# EAGLE schematic esp32-kitchensink (EAGLE 9.6.2)

## Sheet 1 of 8
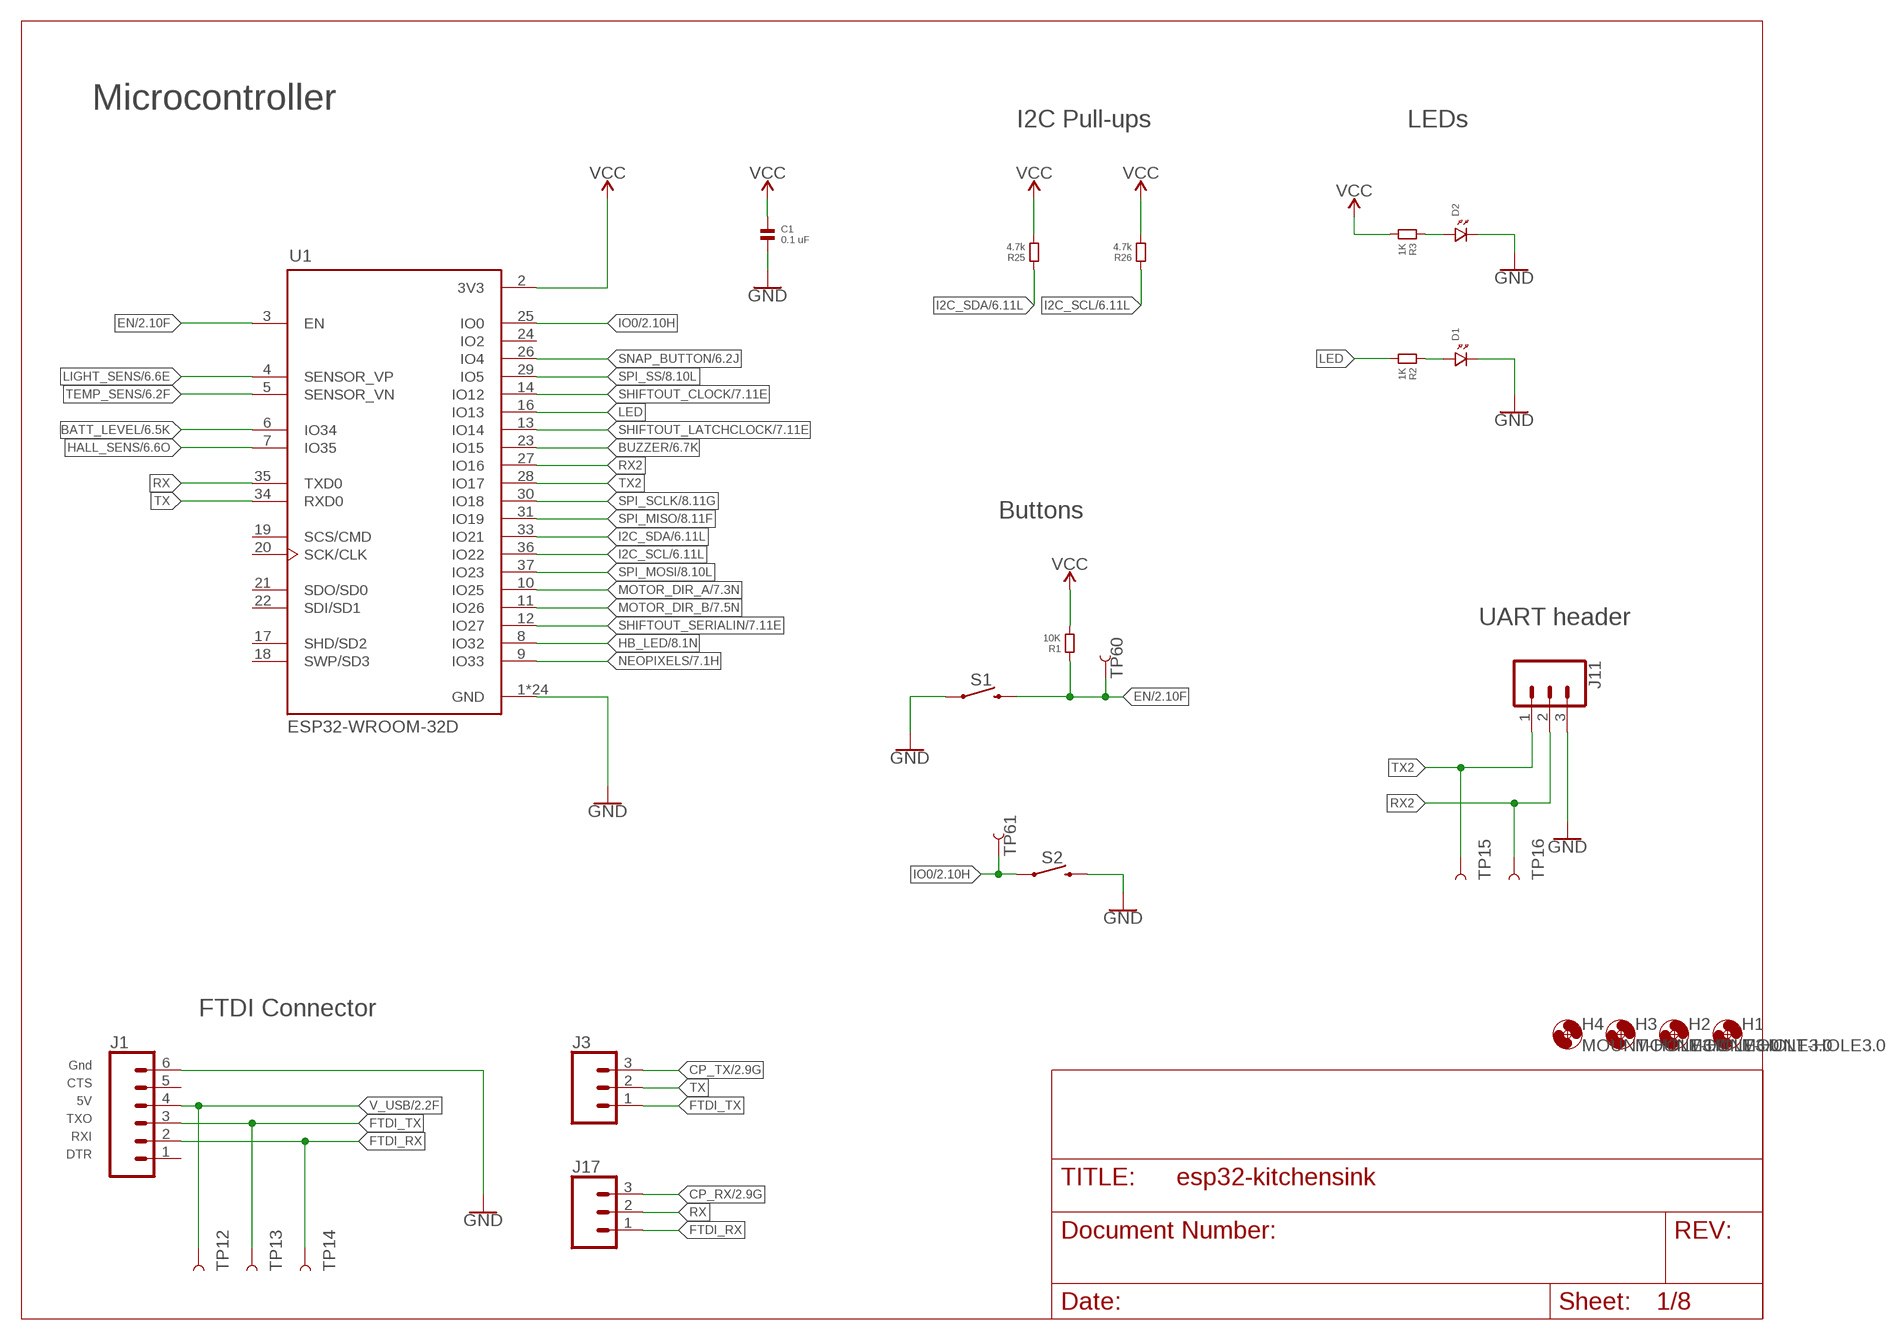
[diagram p0: schematic, sheet 1]

### Parts
C1  0.1 uF  CAPACITOR.1206  [1206]
D1  LED.1206  [1206.LED]
D2  LED.1206  [1206.LED]
H1  MOUNT-HOLE3.0  [3,0]
H2  MOUNT-HOLE3.0  [3,0]
H3  MOUNT-HOLE3.0  [3,0]
H4  MOUNT-HOLE3.0  [3,0]
J1  CONN_06  [1X06-SMD_RA_MALE_NO_HOLES]
J3  CONN_03LONGPADS  [1X03_LONGPADS]
J11  CONN_03SMD_RA_MALE  [1X03_SMD_RA_MALE]
J17  CONN_03LONGPADS  [1X03_LONGPADS]
R1  10K  RESISTOR.1206  [1206]
R2  1K  RESISTOR.1206  [1206]
R3  1K  RESISTOR.1206  [1206]
R25  4.7k  RESISTOR.1206  [1206]
R26  4.7k  RESISTOR.1206  [1206]
S1  MOMENTARY-SWITCH-SPST-SMD-5.2MM  [TACTILE_SWITCH_SMD_5.2MM]
S2  MOMENTARY-SWITCH-SPST-SMD-5.2MM  [TACTILE_SWITCH_SMD_5.2MM]
TP12  TEST-POINT3X5  [PAD.03X.05]
TP13  TEST-POINT3X5  [PAD.03X.05]
TP14  TEST-POINT3X5  [PAD.03X.05]
TP15  TEST-POINT3X5  [PAD.03X.05]
TP16  TEST-POINT3X5  [PAD.03X.05]
TP60  TEST-POINT3X5  [PAD.03X.05]
TP61  TEST-POINT3X5  [PAD.03X.05]
U1  ESP32-WROOM-32D  [MODULE_ESP32-WROOM-32D]

### Nets
BATT_LEVEL: U1.6(IO34) ; also sheet 6
BUZZER: U1.23(IO15) ; also sheet 6
CP_RX: J17.3 ; also sheet 2
CP_TX: J3.3 ; also sheet 2
EN: R1.1 S1.3 TP60.P$1 U1.3(EN) ; also sheet 2
FTDI_RX: J1.2 J17.1 TP14.P$1
FTDI_TX: J1.3 J3.1 TP13.P$1
GND: D1.P$2 D2.P$2 J1.6 J11.3 S1.1 ; also sheet 2,3,4,5,6,7,8
HALL_SENS: U1.7(IO35) ; also sheet 6
HB_LED: U1.8(IO32) ; also sheet 8
I2C_SCL: R26.1 U1.36(IO22) ; also sheet 6,8
I2C_SDA: R25.1 U1.33(IO21) ; also sheet 6,8
IO0: S2.1 TP61.P$1 U1.25(IO0) ; also sheet 2
LED: R2.2 U1.16(IO13)
LIGHT_SENS: U1.4(SENSOR_VP) ; also sheet 6
MOTOR_DIR_A: U1.10(IO25) ; also sheet 7
MOTOR_DIR_B: U1.11(IO26) ; also sheet 7
N$2: C1.1 ; supply symbol labelled VCC
N$3: C1.2 S2.3 ; supply symbol labelled GND
N$4: U1.1(GND) U1.15(GND) U1.38(GND) U1.39_1(GND) U1.39_2(GND) U1.39_3(GND) U1.39_4(GND) U1.39_5(GND) U1.39_6(GND) U1.39_7(GND) U1.39_8(GND) U1.39_9(GND) U1.39_10(GND) U1.39_11(GND) U1.39_12(GND) U1.39_13(GND) U1.39_14(GND) U1.39_15(GND) U1.39_16(GND) U1.39_17(GND) U1.39_18(GND) U1.39_19(GND) U1.39_20(GND) U1.39_21(GND) ; supply symbol labelled GND
N$7: D1.P$1 R2.1
N$8: R3.2 ; supply symbol labelled VCC
N$9: D2.P$1 R3.1
NEOPIXELS: U1.9(IO33) ; also sheet 7
RX: J17.2 U1.35(TXD0)
RX2: J11.2 TP16.P$1 U1.27(IO16)
SHIFTOUT_CLOCK: U1.14(IO12) ; also sheet 7
SHIFTOUT_LATCHCLOCK: U1.13(IO14) ; also sheet 7
SHIFTOUT_SERIALIN: U1.12(IO27) ; also sheet 7
SNAP_BUTTON: U1.26(IO4) ; also sheet 6
SPI_MISO: U1.31(IO19) ; also sheet 8
SPI_MOSI: U1.37(IO23) ; also sheet 8
SPI_SCLK: U1.30(IO18) ; also sheet 8
SPI_SS: U1.29(IO5) ; also sheet 8
TEMP_SENS: U1.5(SENSOR_VN) ; also sheet 6
TX: J3.2 U1.34(RXD0)
TX2: J11.1 TP15.P$1 U1.28(IO17)
V_USB: J1.4 TP12.P$1 ; also sheet 2,3
VCC: R1.2 R25.2 R26.2 U1.2(3V3) ; also sheet 2,3,6,7,8
Unconnected: J1.1 J1.5 U1.17(SHD/SD2) U1.18(SWP/SD3) U1.19(SCS/CMD) U1.20(SCK/CLK) U1.21(SDO/SD0) U1.22(SDI/SD1) U1.24(IO2)

### Notes on the sheet
- Microcontroller
- I2C Pull-ups | LEDs
- Buttons
- UART header
- FTDI Connector
- Gnd
- CTS
- 5V
- TXO
- RXI
- DTR

## Sheet 2 of 8
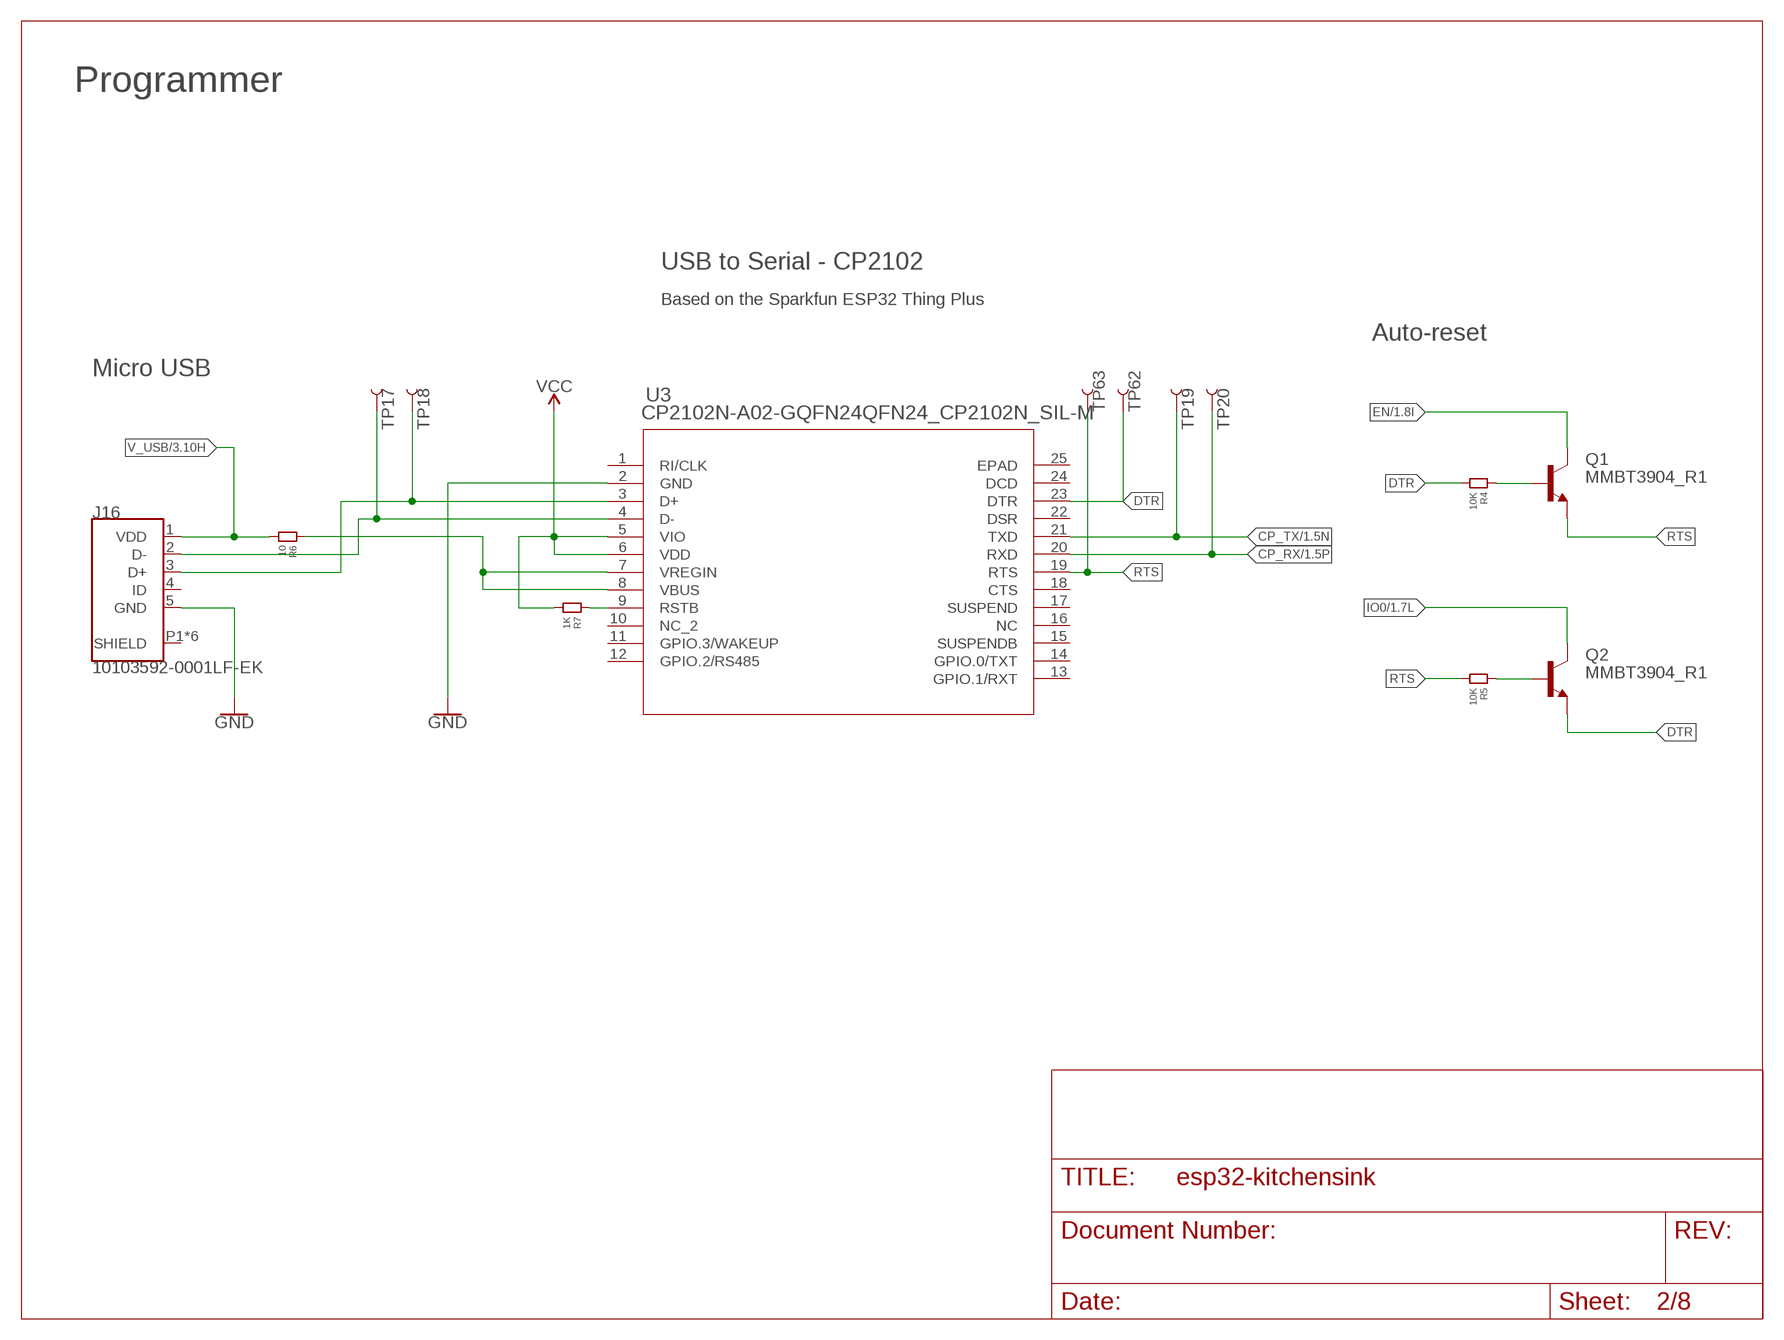
[diagram p1: schematic, sheet 2]

### Parts
J16  10103592-0001LF-EK  [AMPHENOL_10103592-0001LF]
Q1  MMBT3904_R1  BC846  [SOT23]
Q2  MMBT3904_R1  BC846  [SOT23]
R4  10K  RESISTOR.1206  [1206]
R5  10K  RESISTOR.1206  [1206]
R6  10  RESISTOR.1206  [1206]
R7  1K  RESISTOR.1206  [1206]
TP17  TEST-POINT3X5  [PAD.03X.05]
TP18  TEST-POINT3X5  [PAD.03X.05]
TP19  TEST-POINT3X5  [PAD.03X.05]
TP20  TEST-POINT3X5  [PAD.03X.05]
TP62  TEST-POINT3X5  [PAD.03X.05]
TP63  TEST-POINT3X5  [PAD.03X.05]
U3  CP2102N-A02-GQFN24QFN24_CP2102N_SIL-M  [QFN24_CP2102N_SIL-M]

### Nets
CP_RX: TP20.P$1 U3.20(RXD) ; also sheet 1
CP_TX: TP19.P$1 U3.21(TXD) ; also sheet 1
DTR: Q2.2(E) R4.2 TP62.P$1 U3.23(DTR)
EN: Q1.3(C) ; also sheet 1
GND: J16.5(GND) U3.2(GND) ; also sheet 1,3,4,5,6,7,8
IO0: Q2.3(C) ; also sheet 1
N$1: R6.1 U3.7(VREGIN) U3.8(VBUS)
N$5: J16.3(D+) TP18.P$1 U3.3(D+)
N$6: J16.2(D-) TP17.P$1 U3.4(D-)
N$10: Q1.1(B) R4.1
N$11: Q2.1(B) R5.1
N$12: R7.1 U3.9(RSTB)
RTS: Q1.2(E) R5.2 TP63.P$1 U3.19(RTS)
V_USB: J16.1(VDD) R6.2 ; also sheet 1,3
VCC: R7.2 U3.5(VIO) U3.6(VDD) ; also sheet 1,3,6,7,8
Unconnected: J16.4(ID) U3.1(RI/CLK) U3.10(NC_2) U3.11(GPIO.3/WAKEUP) U3.12(GPIO.2/RS485) U3.13(GPIO.1/RXT) U3.14(GPIO.0/TXT) U3.15(SUSPENDB) U3.16(NC) U3.17(SUSPEND) U3.18(CTS) U3.22(DSR) U3.24(DCD) U3.25(EPAD)

### Notes on the sheet
- Programmer
- USB to Serial - CP2102
- Based on the Sparkfun ESP32 Thing Plus
- Auto-reset
- Micro USB

## Sheet 3 of 8
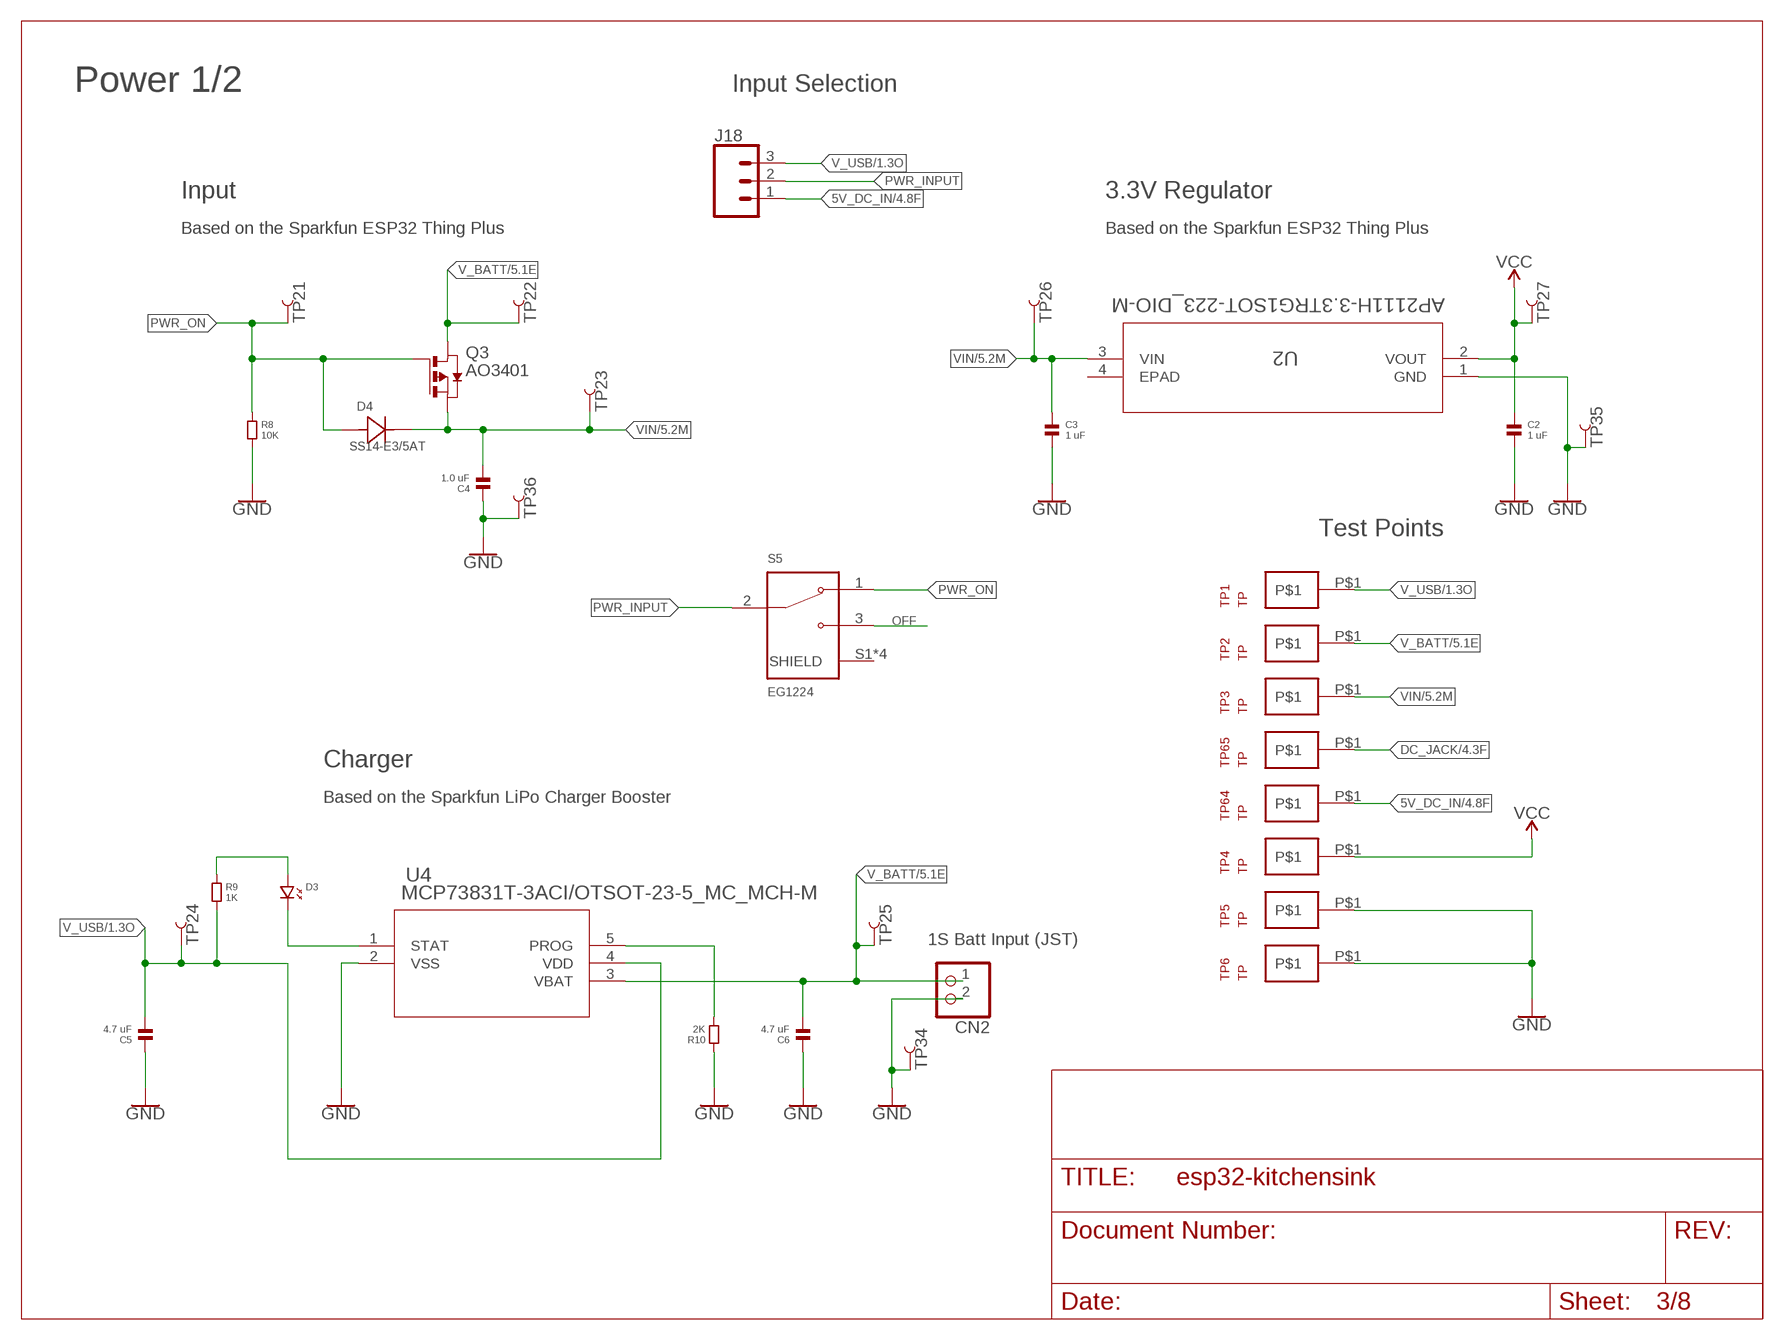
[diagram p2: schematic, sheet 3]

### Parts
C2  1 uF  CAPACITOR.1206  [1206]
C3  1 uF  CAPACITOR.1206  [1206]
C4  1.0 uF  CAPACITOR.1206  [1206]
C5  4.7 uF  CAPACITOR.1206  [1206]
C6  4.7 uF  CAPACITOR.1206  [1206]
CN2  JST_2PIN-THM-RA  [JST-PH-2-THM-RA]
D3  LED.1206  [1206.LED]
D4  SS14-E3/5AT  [DIODE_DO214AC]
J18  CONN_03  [1X03]
Q3  AO3401  [SOT23]
R8  10K  RESISTOR.1206  [1206]
R9  1K  RESISTOR.1206  [1206]
R10  2K  RESISTOR.1206  [1206]
S5  EG1224  [SW_EG1224]
TP1  TP  [TP]
TP2  TP  [TP]
TP3  TP  [TP]
TP4  TP  [TP]
TP5  TP  [TP]
TP6  TP  [TP]
TP21  TEST-POINT3X5  [PAD.03X.05]
TP22  TEST-POINT3X5  [PAD.03X.05]
TP23  TEST-POINT3X5  [PAD.03X.05]
TP24  TEST-POINT3X5  [PAD.03X.05]
TP25  TEST-POINT3X5  [PAD.03X.05]
TP26  TEST-POINT3X5  [PAD.03X.05]
TP27  TEST-POINT3X5  [PAD.03X.05]
TP34  TEST-POINT3X5  [PAD.03X.05]
TP35  TEST-POINT3X5  [PAD.03X.05]
TP36  TEST-POINT3X5  [PAD.03X.05]
TP64  TP  [TP]
TP65  TP  [TP]
U2  AP2111H-3.3TRG1SOT-223_DIO-M  [SOT-223_DIO-M]
U4  MCP73831T-3ACI/OTSOT-23-5_MC_MCH-M  [SOT-23-5_MC_MCH-M]

### Nets
5V_DC_IN: J18.1 TP64.P$1 ; also sheet 4
DC_JACK: TP65.P$1 ; also sheet 4
GND: C2.2 C3.2 C4.1 C5.1 C6.1 CN2.2 R8.2 R10.1 TP5.P$1 TP6.P$1 TP34.P$1 TP35.P$1 TP36.P$1 U2.1(GND) U4.2(VSS) ; also sheet 1,2,4,5,6,7,8
N$13: D3.P$1 R9.1
N$14: D3.P$2 U4.1(STAT)
N$15: R10.2 U4.5(PROG)
OFF: S5.3
PWR_INPUT: J18.2 S5.2
PWR_ON: D4.2 Q3.1(G) R8.1 S5.1 TP21.P$1
V_BATT: C6.2 CN2.1 Q3.3(D) TP2.P$1 TP22.P$1 TP25.P$1 U4.3(VBAT) ; also sheet 5,6
V_USB: C5.2 J18.3 R9.2 TP1.P$1 TP24.P$1 U4.4(VDD) ; also sheet 1,2
VCC: C2.1 TP4.P$1 TP27.P$1 U2.2(VOUT) ; also sheet 1,2,6,7,8
VIN: C3.1 C4.2 D4.1 Q3.2(S) TP3.P$1 TP23.P$1 TP26.P$1 U2.3(VIN) ; also sheet 5
Unconnected: S5.S1(SHIELD) S5.S2(SHIELD) S5.S3(SHIELD) S5.S4(SHIELD) U2.4(EPAD)

### Notes on the sheet
- Power 1/2 | Input Selection
- Input | 3.3V Regulator
- Based on the Sparkfun ESP32 Thing Plus | Based on the Sparkfun ESP32 Thing Plus
- Test Points
- Charger
- Based on the Sparkfun LiPo Charger Booster
- 1S Batt Input (JST)

## Sheet 4 of 8
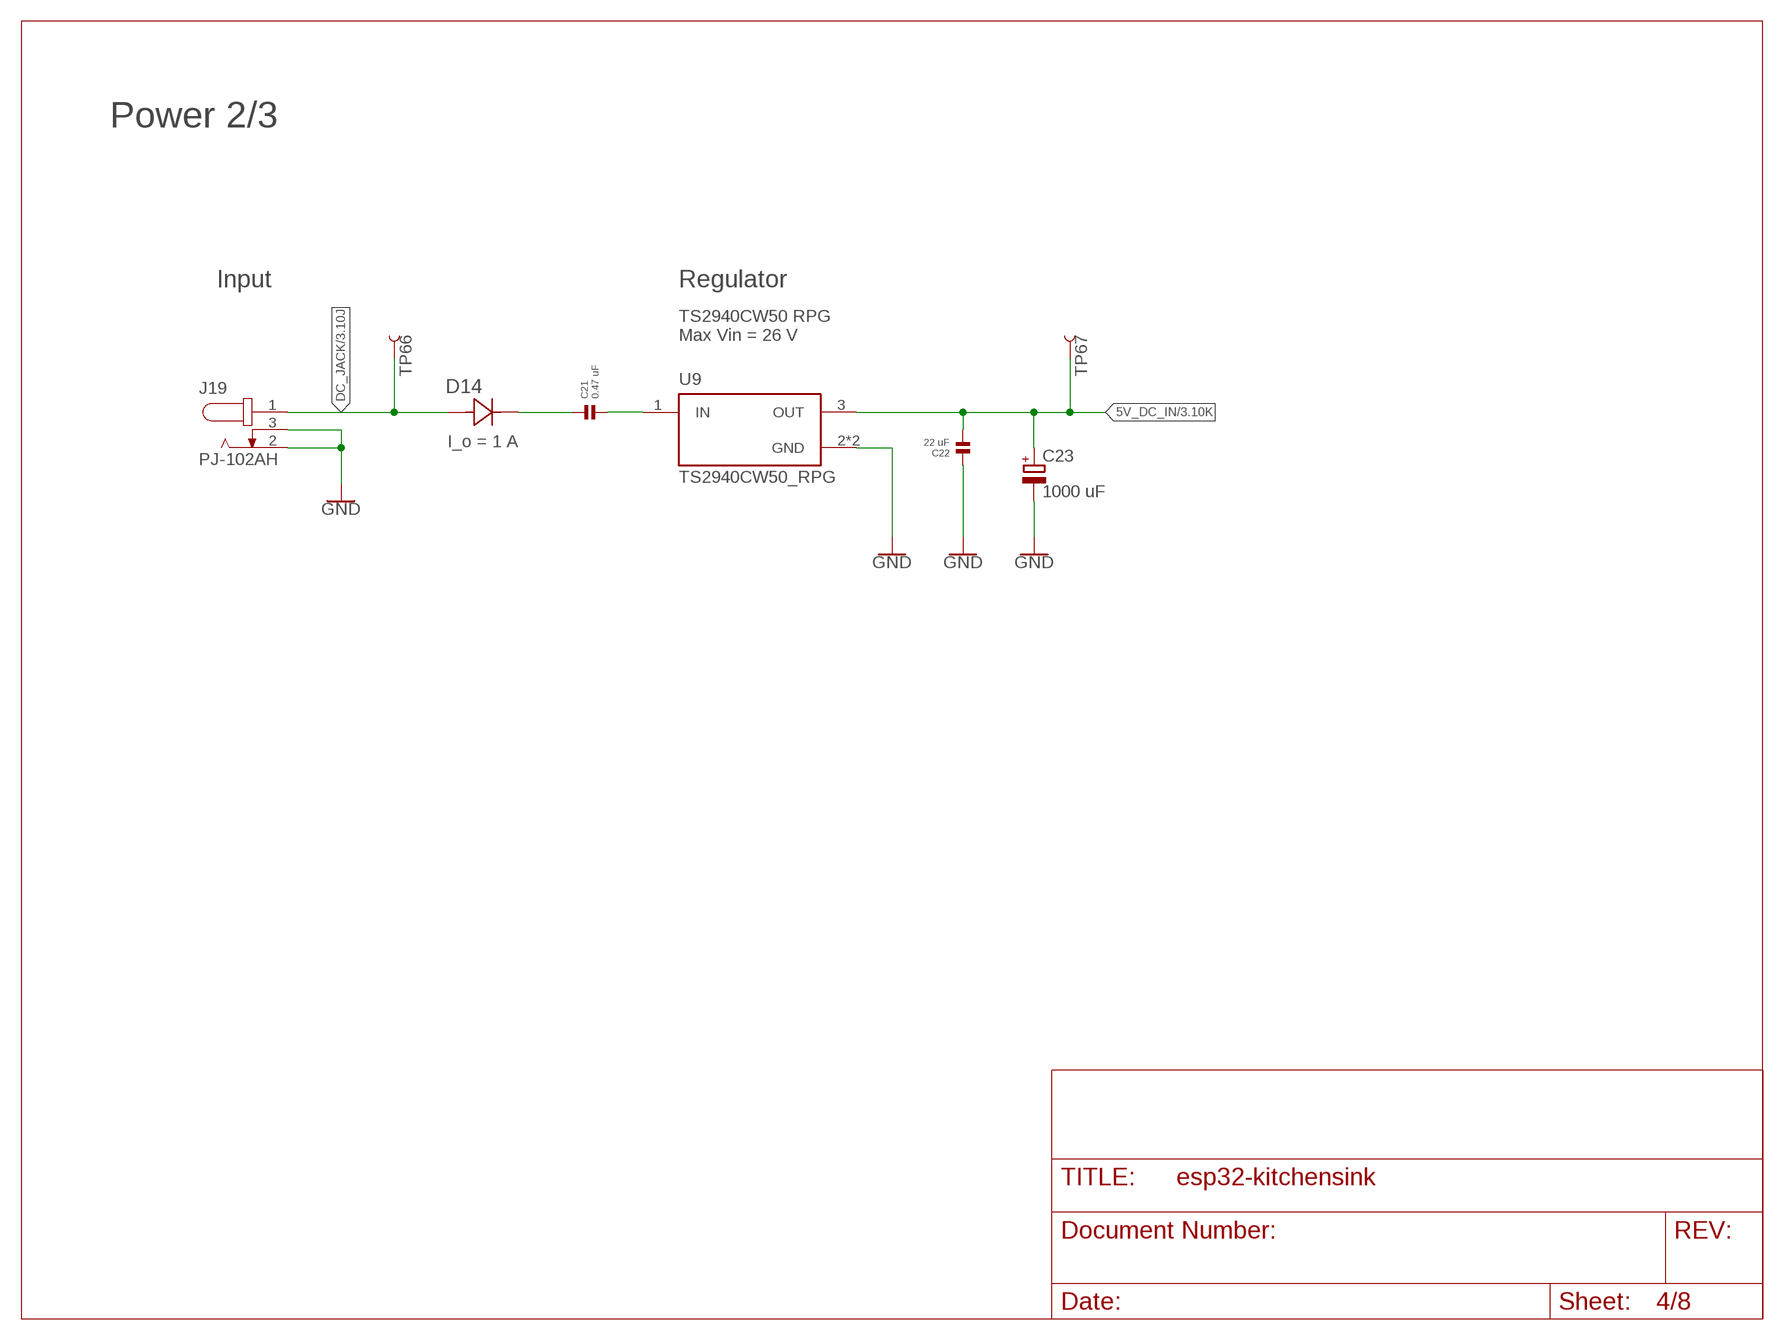
[diagram p3: schematic, sheet 4]

### Parts
C21  0.47 uF  CAPACITOR.1206  [1206]
C22  22 uF  CAPACITOR.1206  [1206]
C23  1000 uF  CPOL-EU140CLH-1010  [140CLH-1010]
D14  RS1BB-13-FSMA_DIO-M  [SMA_DIO-M]
J19  PJ-102AH  [CUI_PJ-102AH]
TP66  TEST-POINT3X5  [PAD.03X.05]
TP67  TEST-POINT3X5  [PAD.03X.05]
U9  TS2940CW50_RPG  [VREG_TS2940CW50_RPG]

### Nets
5V_DC_IN: C22.2 C23.+ TP67.P$1 U9.3(OUT) ; also sheet 3
DC_JACK: D14.2 J19.1 TP66.P$1 ; also sheet 3
GND: C22.1 C23.- J19.2 J19.3 U9.2(GND) U9.4(GND) ; also sheet 1,2,3,5,6,7,8
N$32: C21.2 U9.1(IN)
N$43: C21.1 D14.1

### Notes on the sheet
- Power 2/3
- Input | Regulator
- TS2940CW50 RPG
  Max Vin = 26 V
- I_o = 1 A

## Sheet 5 of 8
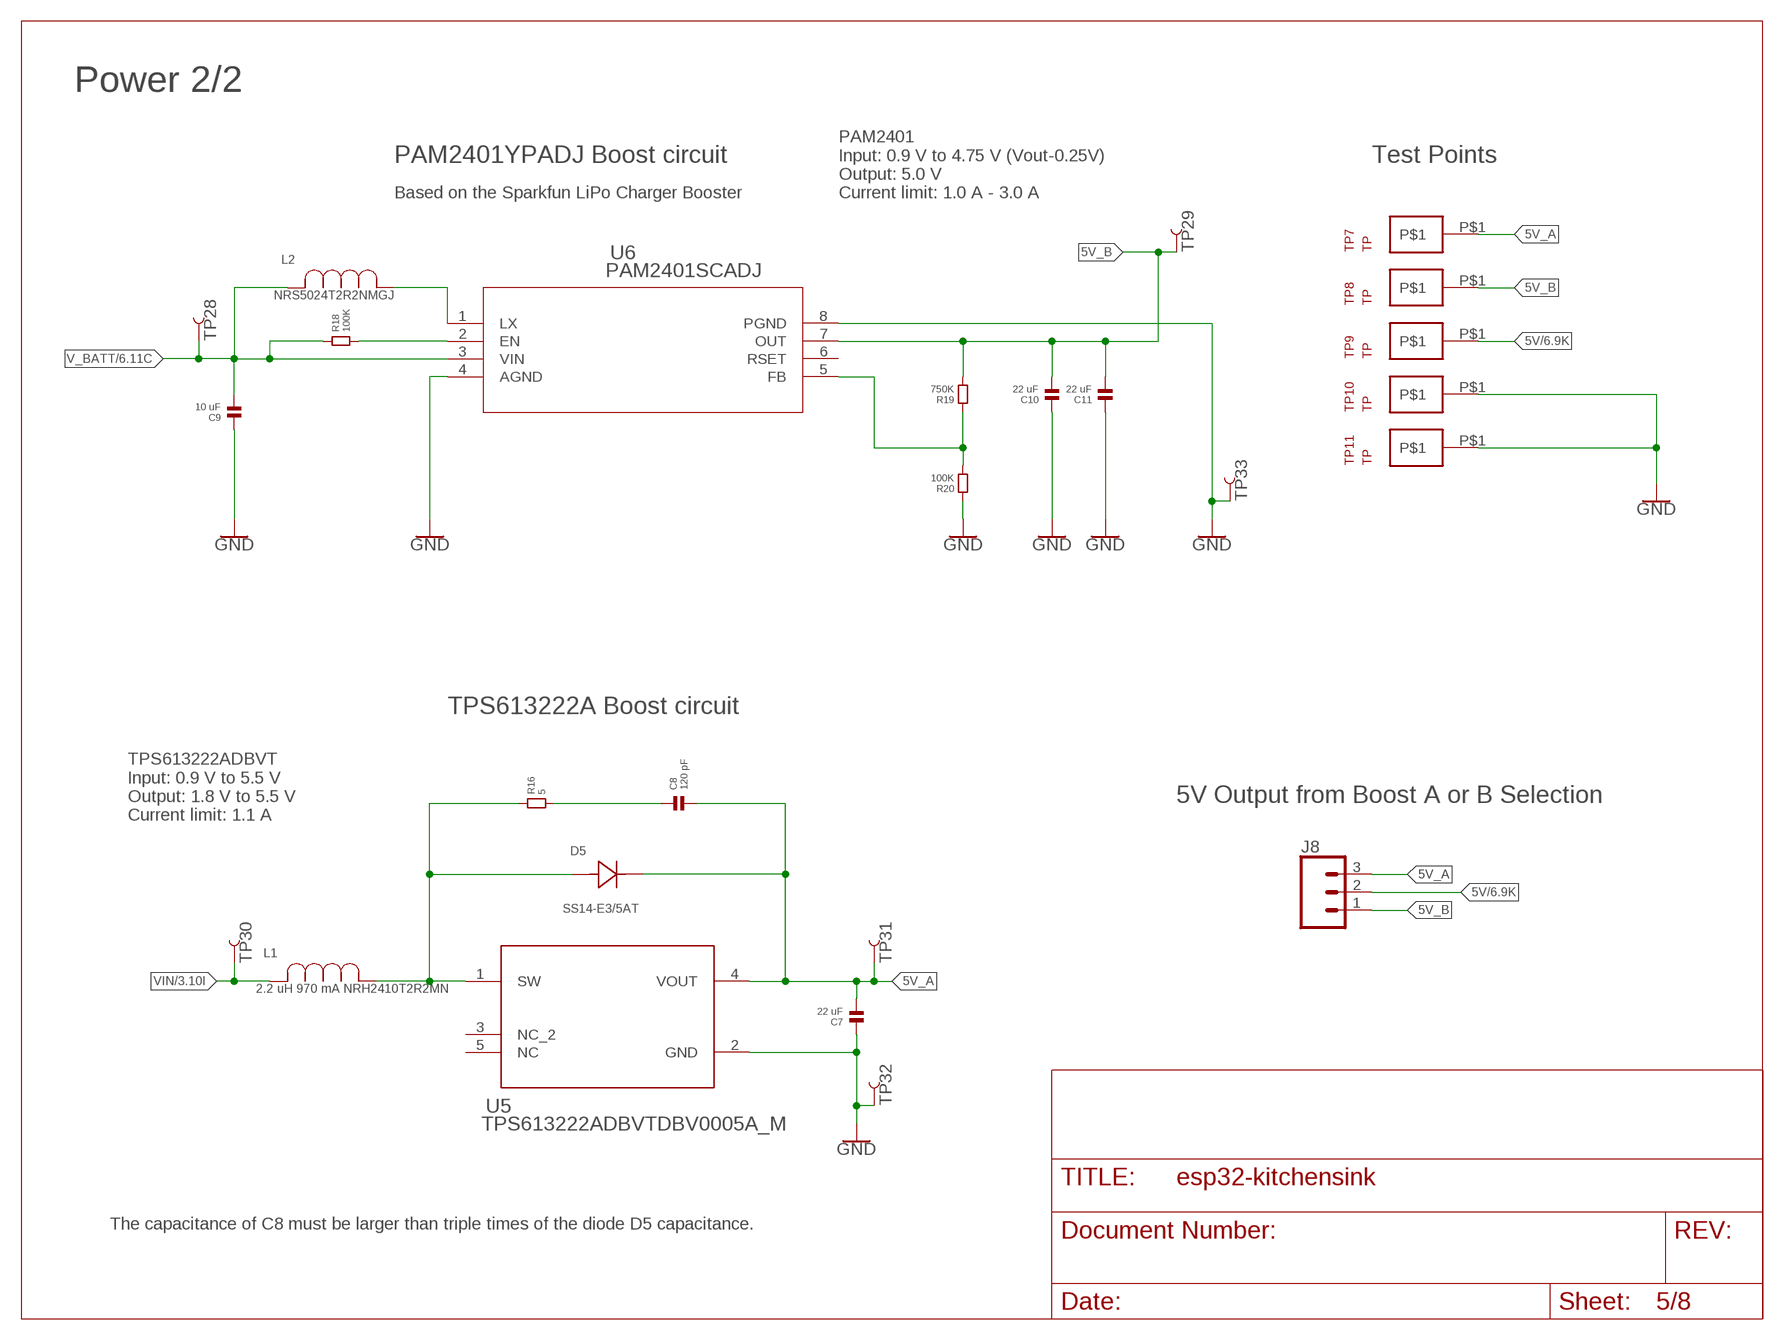
[diagram p4: schematic, sheet 5]

### Parts
C7  22 uF  CAPACITOR.1206  [1206]
C8  120 pF  CAPACITOR.1206  [1206]
C9  10 uF  CAPACITOR.1206  [1206]
C10  22 uF  CAPACITOR.1206  [1206]
C11  22 uF  CAPACITOR.1206  [1206]
D5  SS14-E3/5AT  [DIODE_DO214AC]
J8  CONN_03  [1X03]
L1  2.2 uH 970 mA NRH2410T2R2MN  NRH2410T2R2MN  [IND_TAIYO_NRH2410_TAY]
L2  NRS5024T2R2NMGJ  [IND_NRS5024_TAY]
R16  5  RESISTOR.1206  [1206]
R18  100K  RESISTOR.1206  [1206]
R19  750K  RESISTOR.1206  [1206]
R20  100K  RESISTOR.1206  [1206]
TP7  TP  [TP]
TP8  TP  [TP]
TP9  TP  [TP]
TP10  TP  [TP]
TP11  TP  [TP]
TP28  TEST-POINT3X5  [PAD.03X.05]
TP29  TEST-POINT3X5  [PAD.03X.05]
TP30  TEST-POINT3X5  [PAD.03X.05]
TP31  TEST-POINT3X5  [PAD.03X.05]
TP32  TEST-POINT3X5  [PAD.03X.05]
TP33  TEST-POINT3X5  [PAD.03X.05]
U5  TPS613222ADBVTDBV0005A_M  [DBV0005A_M]
U6  PAM2401SCADJ  [MSOP8_DIO]

### Nets
5V: J8.2 TP9.P$1 ; also sheet 6,7,8
5V_A: C7.2 C8.2 D5.1 J8.3 TP7.P$1 TP31.P$1 U5.4(VOUT)
5V_B: C10.2 C11.2 J8.1 R19.2 TP8.P$1 TP29.P$1 U6.7(OUT)
GND: C7.1 C9.1 C10.1 C11.1 R20.1 TP10.P$1 TP11.P$1 TP32.P$1 TP33.P$1 U5.2(GND) U6.4(AGND) U6.8(PGND) ; also sheet 1,2,3,4,6,7,8
N$16: L2.1 U6.1(LX)
N$17: D5.2 L1.1 R16.1 U5.1(SW)
N$22: C8.1 R16.2
N$25: R18.2 U6.2(EN)
N$26: R19.1 R20.2 U6.5(FB)
V_BATT: C9.2 L2.2 R18.1 TP28.P$1 U6.3(VIN) ; also sheet 3,6
VIN: L1.2 TP30.P$1 ; also sheet 3
Unconnected: U5.3(NC_2) U5.5(NC) U6.6(RSET)

### Notes on the sheet
- Power 2/2
- PAM2401YPADJ Boost circuit | Test Points
- Based on the Sparkfun LiPo Charger Booster
- PAM2401 
  Input: 0.9 V to 4.75 V (Vout-0.25V)
  Output: 5.0 V 
  Current limit: 1.0 A - 3.0 A
- TPS613222A Boost circuit
- 5V Output from Boost A or B Selection
- TPS613222ADBVT
  Input: 0.9 V to 5.5 V 
  Output: 1.8 V to 5.5 V 
  Current limit: 1.1 A
- The capacitance of C8 must be larger than triple times of the diode D5 capacitance.

## Sheet 6 of 8
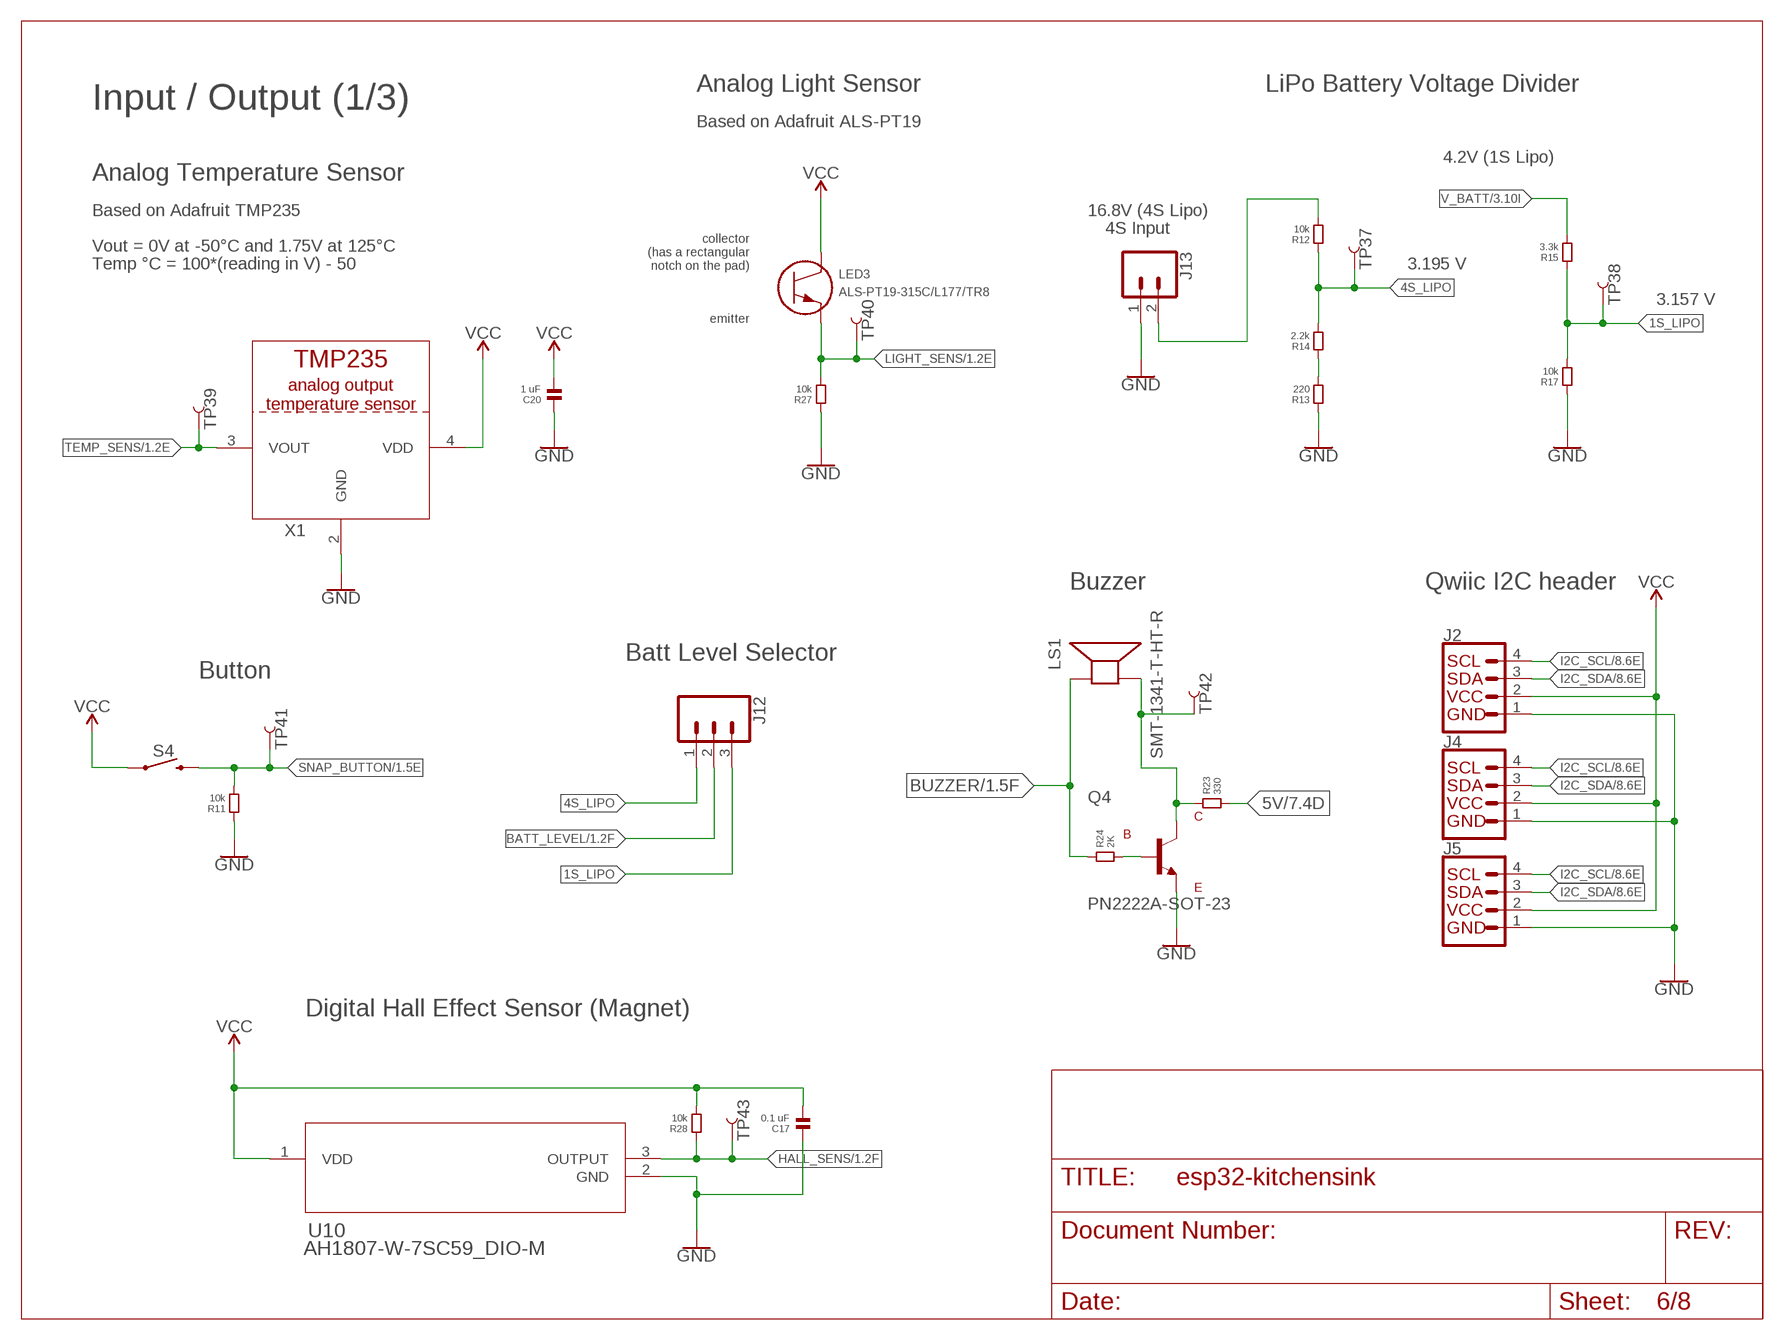
[diagram p5: schematic, sheet 6]

### Parts
C17  0.1 uF  CAPACITOR.1206  [1206]
C20  1 uF  CAPACITOR.1206  [1206]
J2  QWIIC_CONNECTORJS-1MM  [1X04_1MM_RA]
J4  QWIIC_CONNECTORJS-1MM  [1X04_1MM_RA]
J5  QWIIC_CONNECTORJS-1MM  [1X04_1MM_RA]
J12  CONN_03LONGPADS  [1X03_LONGPADS]
J13  CONN_02LOCK_LONGPADS  [1X02_LOCK_LONGPADS]
LED3  ALS-PT19-315C/L177/TR8  [LED_77/TR8_EVE]
LS1  SMT-1341-T-HT-R  [XDCR_SMT-1341-T-HT-R]
Q4  PN2222A-SOT-23  [PN2222A-SOT-23]
R11  10k  RESISTOR.1206  [1206]
R12  10k  RESISTOR.1206  [1206]
R13  220  RESISTOR.1206  [1206]
R14  2.2k  RESISTOR.1206  [1206]
R15  3.3k  RESISTOR.1206  [1206]
R17  10k  RESISTOR.1206  [1206]
R23  330  RESISTOR.1206  [1206]
R24  2K  RESISTOR.1206  [1206]
R27  10k  RESISTOR.1206  [1206]
R28  10k  RESISTOR.1206  [1206]
S4  MOMENTARY-SWITCH-SPST-SMD-5.2MM  [TACTILE_SWITCH_SMD_5.2MM]
TP37  TEST-POINT3X5  [PAD.03X.05]
TP38  TEST-POINT3X5  [PAD.03X.05]
TP39  TEST-POINT3X5  [PAD.03X.05]
TP40  TEST-POINT3X5  [PAD.03X.05]
TP41  TEST-POINT3X5  [PAD.03X.05]
TP42  TEST-POINT3X5  [PAD.03X.05]
TP43  TEST-POINT3X5  [PAD.03X.05]
U10  AH1807-W-7SC59_DIO-M  [SC59_DIO-M]
X1  TMP235_DCKR  [SC70-5]

### Nets
1S_LIPO: J12.3 R15.1 R17.2 TP38.P$1
4S_LIPO: J12.1 R12.1 R14.2 TP37.P$1
5V: R23.2 ; also sheet 5,7,8
BATT_LEVEL: J12.2 ; also sheet 1
BUZZER: LS1.P R24.1 ; also sheet 1
GND: C17.1 C20.1 J2.1(GND) J4.1(GND) J5.1(GND) J13.1 Q4.EMITTER R11.1 R13.1 R17.1 R27.1 U10.2(GND) X1.2(GND) ; also sheet 1,2,3,4,5,7,8
HALL_SENS: R28.1 TP43.P$1 U10.3(OUTPUT) ; also sheet 1
I2C_SCL: J2.4(SCL) J4.4(SCL) J5.4(SCL) ; also sheet 1,8
I2C_SDA: J2.3(SDA) J4.3(SDA) J5.3(SDA) ; also sheet 1,8
LIGHT_SENS: LED3.2 R27.2 TP40.P$1 ; also sheet 1
N$20: J13.2 R12.2
N$21: R13.2 R14.1
N$33: LS1.N Q4.COLLECTOR R23.1 TP42.P$1
N$35: Q4.BASE R24.2
SNAP_BUTTON: R11.2 S4.3 TP41.P$1 ; also sheet 1
TEMP_SENS: TP39.P$1 X1.3(VOUT) ; also sheet 1
V_BATT: R15.2 ; also sheet 3,5
VCC: C17.2 C20.2 J2.2(VCC) J4.2(VCC) J5.2(VCC) LED3.1 R28.2 S4.1 U10.1(VDD) X1.4(VDD) ; also sheet 1,2,3,7,8

### Notes on the sheet
- Analog Light Sensor | LiPo Battery Voltage Divider
- Input / Output (1/3)
- Based on Adafruit ALS-PT19
- 4.2V (1S Lipo)
- Analog Temperature Sensor
- Based on Adafruit TMP235 | 16.8V (4S Lipo)
- 4S Input
- Vout = 0V at -50°C and 1.75V at 125°C
- Temp °C = 100*(reading in V) - 50
- collector
  (has a rectangular
  notch on the pad)
- 3.195 V
- 3.157 V
- emitter
- Buzzer | Qwiic I2C header
- Batt Level Selector
- Button
- Digital Hall Effect Sensor (Magnet)

## Sheet 7 of 8
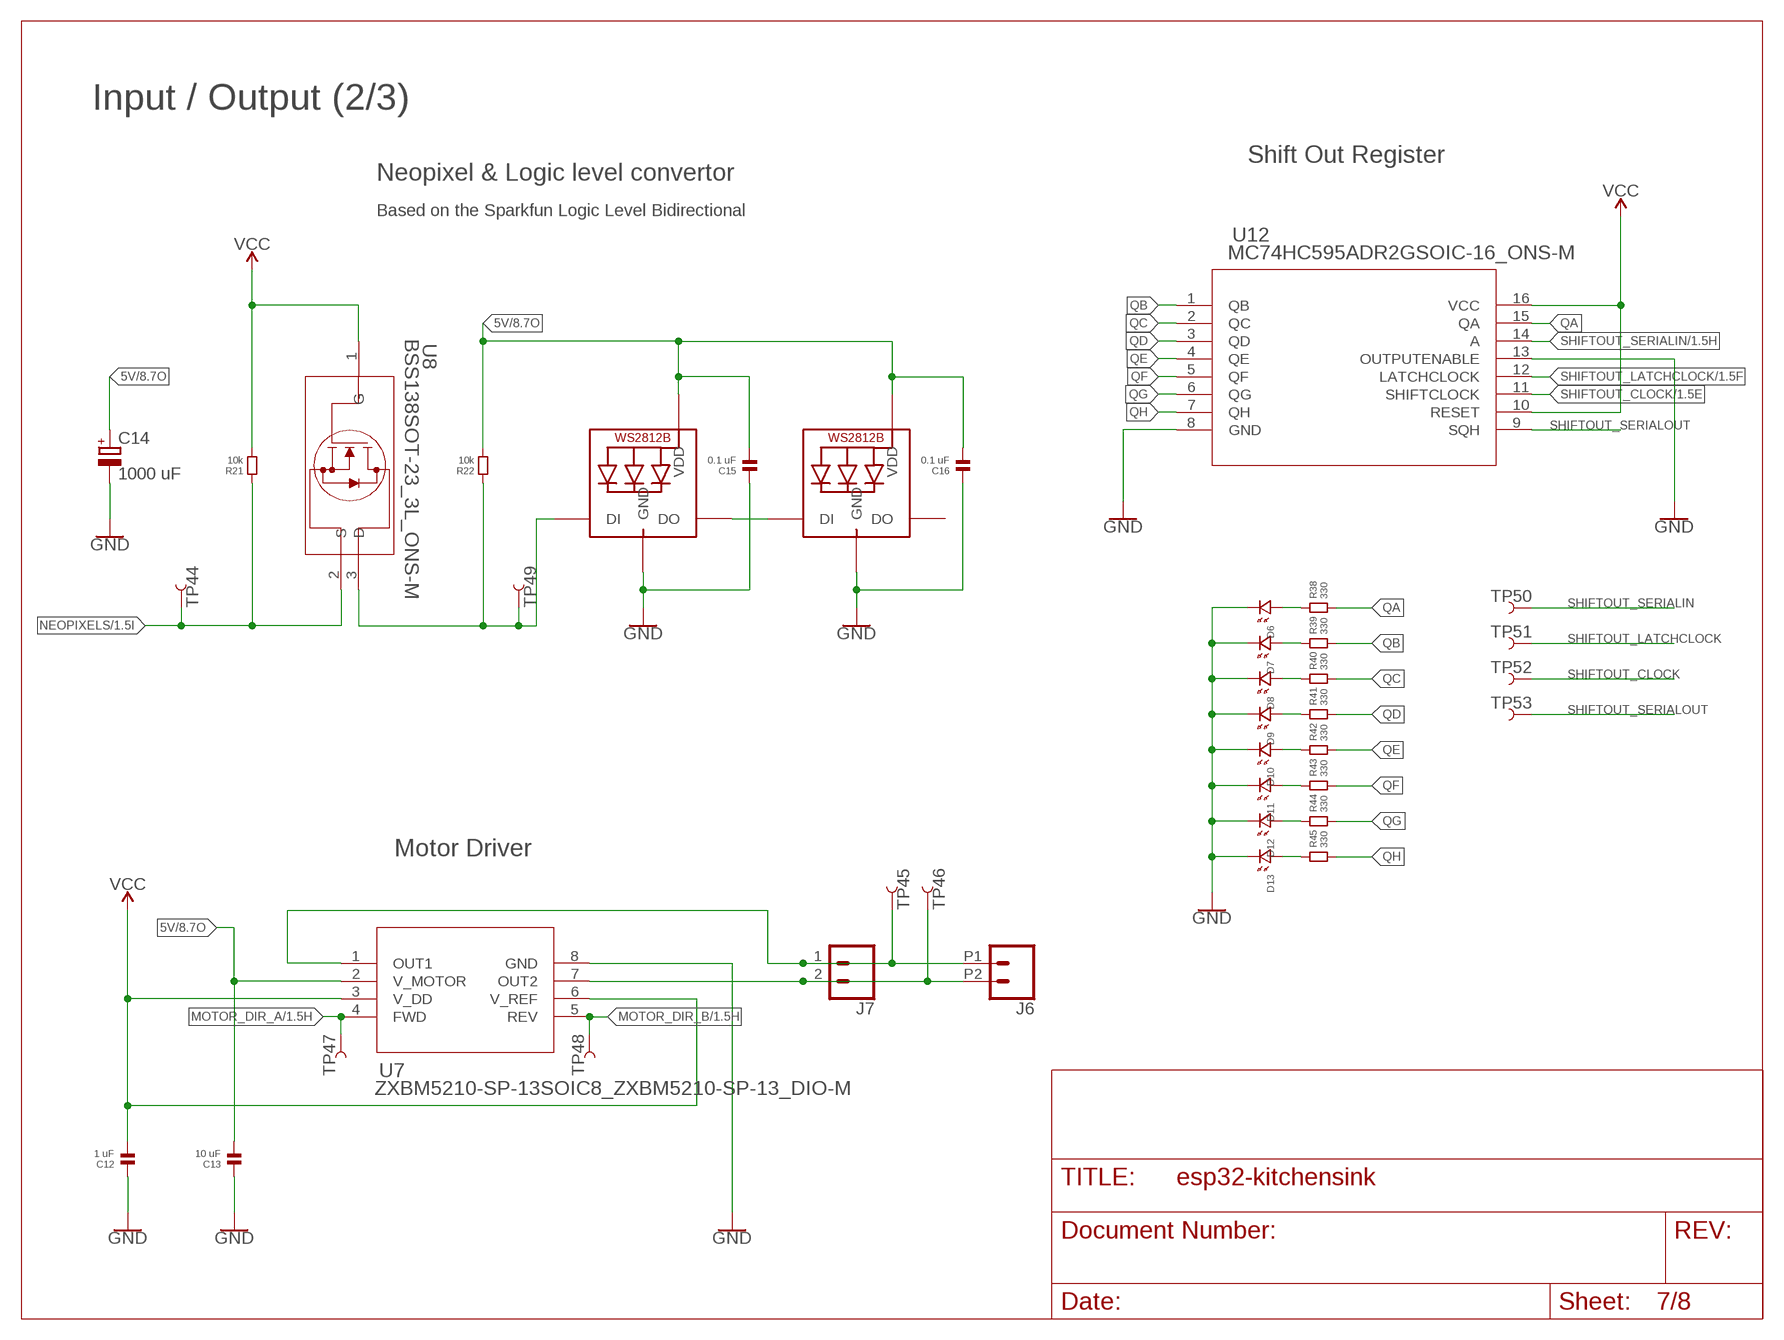
[diagram p6: schematic, sheet 7]

### Parts
C12  1 uF  CAPACITOR.1206  [1206]
C13  10 uF  CAPACITOR.1206  [1206]
C14  1000 uF  CPOL-EU140CLH-1010  [140CLH-1010]
C15  0.1 uF  CAPACITOR.1206  [1206]
C16  0.1 uF  CAPACITOR.1206  [1206]
D6  LED.1206  [1206.LED]
D7  LED.1206  [1206.LED]
D8  LED.1206  [1206.LED]
D9  LED.1206  [1206.LED]
D10  LED.1206  [1206.LED]
D11  LED.1206  [1206.LED]
D12  LED.1206  [1206.LED]
D13  LED.1206  [1206.LED]
J6  CONN_022.54MM_SCREWTERM  [1X02_2.54_SCREWTERM]
J7  CONN_02  [1X02]
LED1  WS2812B5050  [WS2812B]
LED2  WS2812B5050  [WS2812B]
R21  10k  RESISTOR.1206  [1206]
R22  10k  RESISTOR.1206  [1206]
R38  330  RESISTOR.1206  [1206]
R39  330  RESISTOR.1206  [1206]
R40  330  RESISTOR.1206  [1206]
R41  330  RESISTOR.1206  [1206]
R42  330  RESISTOR.1206  [1206]
R43  330  RESISTOR.1206  [1206]
R44  330  RESISTOR.1206  [1206]
R45  330  RESISTOR.1206  [1206]
TP44  TEST-POINT3X5  [PAD.03X.05]
TP45  TEST-POINT3X5  [PAD.03X.05]
TP46  TEST-POINT3X5  [PAD.03X.05]
TP47  TEST-POINT3X5  [PAD.03X.05]
TP48  TEST-POINT3X5  [PAD.03X.05]
TP49  TEST-POINT3X5  [PAD.03X.05]
TP50  TEST-POINT3X5  [PAD.03X.05]
TP51  TEST-POINT3X5  [PAD.03X.05]
TP52  TEST-POINT3X5  [PAD.03X.05]
TP53  TEST-POINT3X5  [PAD.03X.05]
U7  ZXBM5210-SP-13SOIC8_ZXBM5210-SP-13_DIO-M  [SOIC8_ZXBM5210-SP-13_DIO-M]
U8  BSS138SOT-23_3L_ONS-M  [SOT-23_3L_ONS-M]
U12  MC74HC595ADR2GSOIC-16_ONS-M  [SOIC-16_ONS-M]

### Nets
5V: C13.2 C14.+ C15.2 C16.2 LED1.1-VDD(VDD) LED2.1-VDD(VDD) R22.2 U7.2(V_MOTOR) ; also sheet 5,6,8
GND: C12.1 C13.1 C14.- C15.1 C16.1 D6.P$2 D7.P$2 D8.P$2 D9.P$2 D10.P$2 D11.P$2 D12.P$2 D13.P$2 LED1.3-GND(GND) LED2.3-GND(GND) U7.8(GND) U12.8(GND) U12.13(OUTPUTENABLE) ; also sheet 1,2,3,4,5,6,8
MOTOR_DIR_A: TP47.P$1 U7.4(FWD) ; also sheet 1
MOTOR_DIR_B: TP48.P$1 U7.5(REV) ; also sheet 1
N$27: C12.2 U7.3(V_DD) U7.6(V_REF) ; supply symbol labelled VCC
N$28: J6.P2 J7.2 TP46.P$1 U7.7(OUT2)
N$29: J6.P1 J7.1 TP45.P$1 U7.1(OUT1)
N$30: LED1.4-DIN(DI) R22.1 TP49.P$1 U8.3(D)
N$31: D6.P$1 R38.1
N$34: LED1.2-DOUT(DO) LED2.4-DIN(DI)
N$40: D7.P$1 R39.1
N$42: D8.P$1 R40.1
N$44: D9.P$1 R41.1
N$46: D10.P$1 R42.1
N$48: D11.P$1 R43.1
N$50: D12.P$1 R44.1
N$52: D13.P$1 R45.1
NEOPIXELS: R21.1 TP44.P$1 U8.2(S) ; also sheet 1
QA: R38.2 U12.15(QA)
QB: R39.2 U12.1(QB)
QC: R40.2 U12.2(QC)
QD: R41.2 U12.3(QD)
QE: R42.2 U12.4(QE)
QF: R43.2 U12.5(QF)
QG: R44.2 U12.6(QG)
QH: R45.2 U12.7(QH)
SHIFTOUT_CLOCK: TP52.P$1 U12.11(SHIFTCLOCK) ; also sheet 1
SHIFTOUT_LATCHCLOCK: TP51.P$1 U12.12(LATCHCLOCK) ; also sheet 1
SHIFTOUT_SERIALIN: TP50.P$1 U12.14(A) ; also sheet 1
SHIFTOUT_SERIALOUT: TP53.P$1 U12.9(SQH)
VCC: R21.2 U8.1(G) U12.10(RESET) U12.16(VCC) ; also sheet 1,2,3,6,8
Unconnected: LED2.2-DOUT(DO)

### Notes on the sheet
- Input / Output (2/3)
- Shift Out Register
- Neopixel & Logic level convertor
- Based on the Sparkfun Logic Level Bidirectional
- Motor Driver

## Sheet 8 of 8
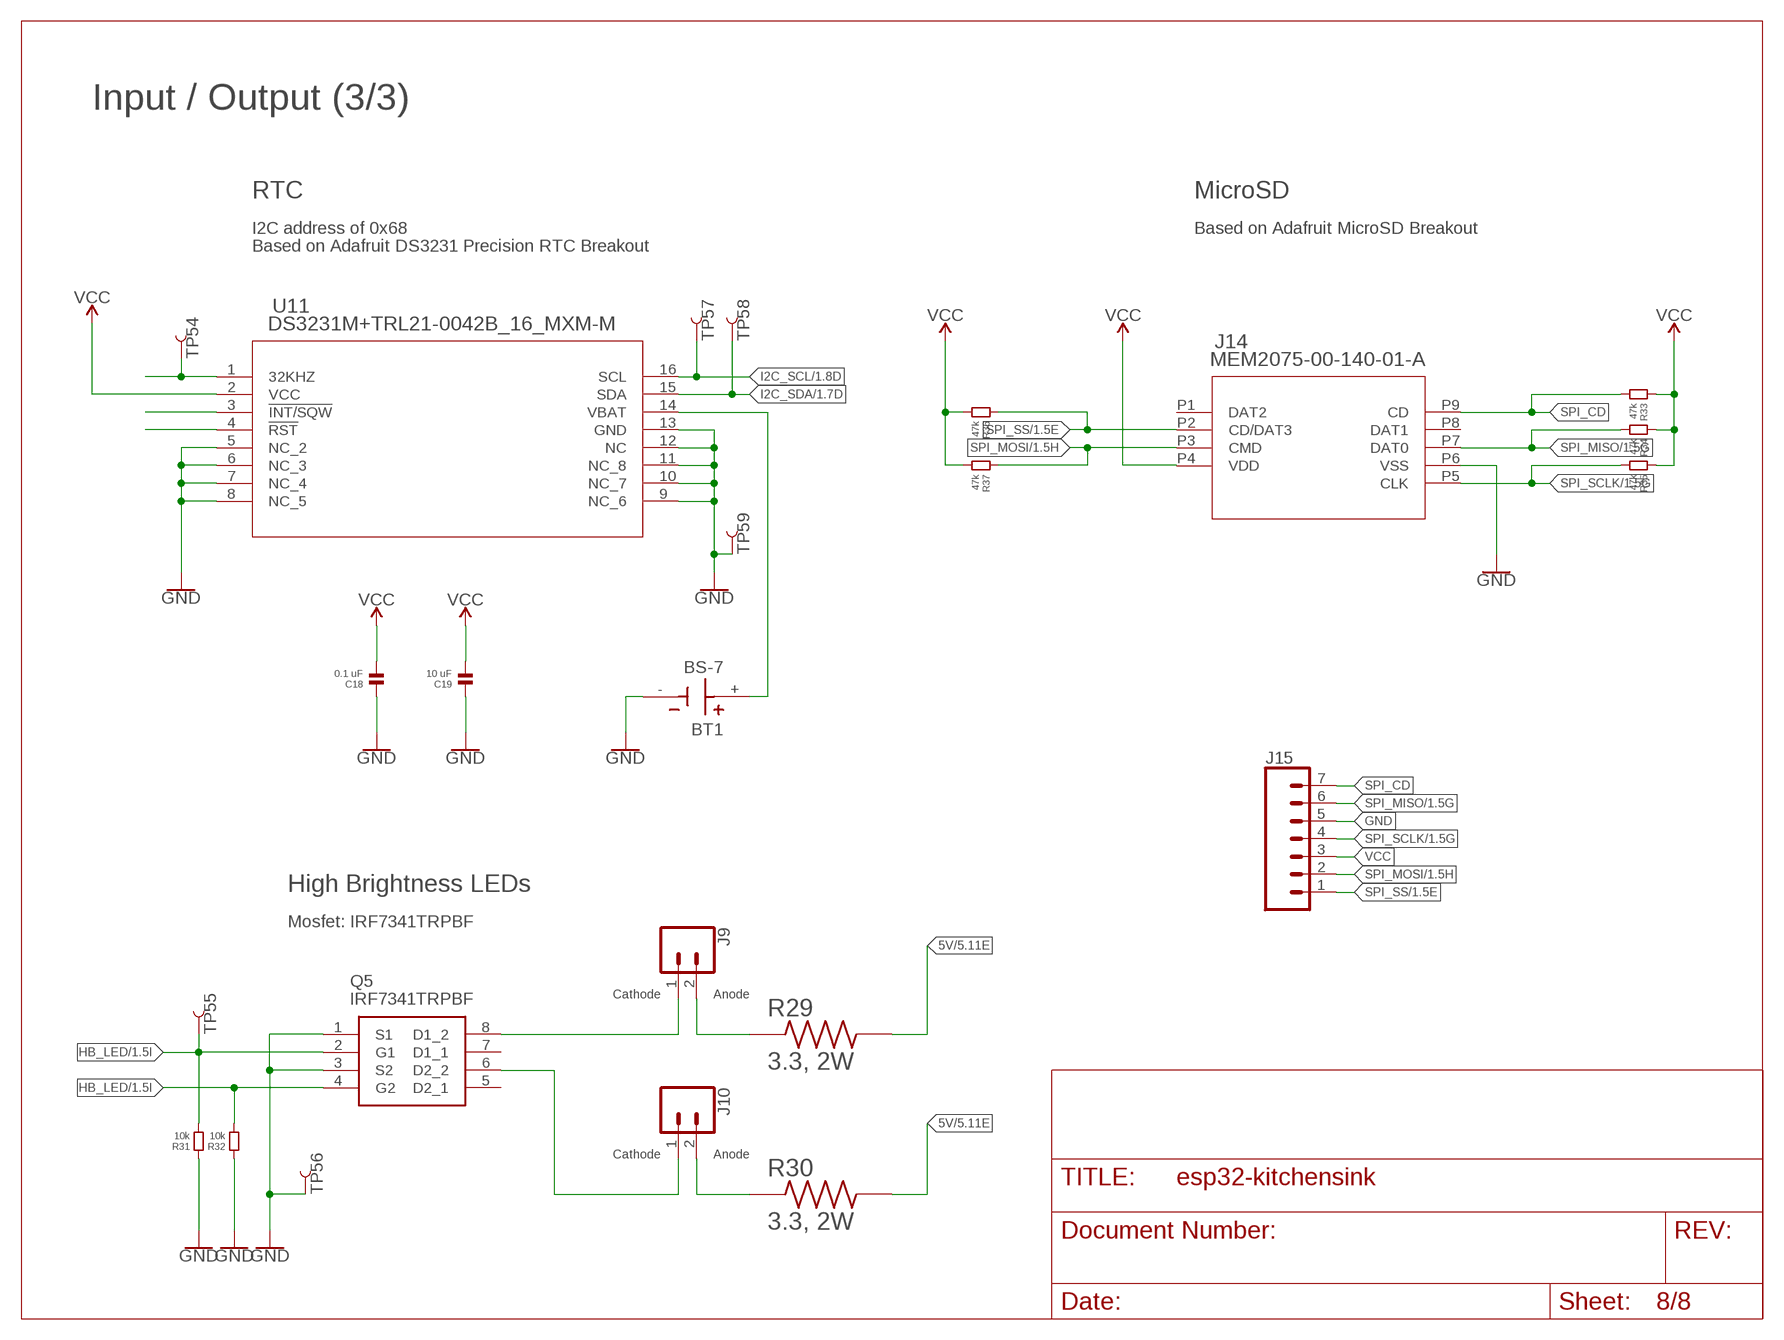
[diagram p7: schematic, sheet 8]

### Parts
BT1  BS-7  [BAT_BS-7]
C18  0.1 uF  CAPACITOR.1206  [1206]
C19  10 uF  CAPACITOR.1206  [1206]
J9  CONN_025MM  [SCREWTERMINAL-5MM-2]
J10  CONN_025MM  [SCREWTERMINAL-5MM-2]
J14  MEM2075-00-140-01-A  [MEM2075-00-140-01-A_GCT]
J15  CONN_07LONGPADS  [1X07_LONGPADS]
Q5  IRF7341TRPBF  [SOIC127P600X175-8N]
R29  3.3, 2W  CRM2512-JW-3R3ELF  [RESC6331X80N]
R30  3.3, 2W  CRM2512-JW-3R3ELF  [RESC6331X80N]
R31  10k  RESISTOR.1206  [1206]
R32  10k  RESISTOR.1206  [1206]
R33  47k  RESISTOR.1206  [1206]
R34  47k  RESISTOR.1206  [1206]
R35  47k  RESISTOR.1206  [1206]
R36  47k  RESISTOR.1206  [1206]
R37  47k  RESISTOR.1206  [1206]
TP54  TEST-POINT3X5  [PAD.03X.05]
TP55  TEST-POINT3X5  [PAD.03X.05]
TP56  TEST-POINT3X5  [PAD.03X.05]
TP57  TEST-POINT3X5  [PAD.03X.05]
TP58  TEST-POINT3X5  [PAD.03X.05]
TP59  TEST-POINT3X5  [PAD.03X.05]
U11  DS3231M+TRL21-0042B_16_MXM-M  [21-0042B_16_MXM-M]

### Nets
5V: R29.2 R30.2 ; also sheet 5,6,7
GND: BT1.- C18.1 C19.1 J14.P6(VSS) J15.5 Q5.1(S1) Q5.3(S2) R31.1 R32.1 TP56.P$1 TP59.P$1 U11.5(NC_2) U11.6(NC_3) U11.7(NC_4) U11.8(NC_5) U11.9(NC_6) U11.10(NC_7) U11.11(NC_8) U11.12(NC) U11.13(GND) ; also sheet 1,2,3,4,5,6,7
HB_LED: Q5.2(G1) Q5.4(G2) R31.2 R32.2 TP55.P$1 ; also sheet 1
I2C_SCL: TP57.P$1 U11.16(SCL) ; also sheet 1,6
I2C_SDA: TP58.P$1 U11.15(SDA) ; also sheet 1,6
N$18: TP54.P$1 U11.1(32KHZ)
N$19: U11.3(!INT/SQW)
N$23: U11.4(!RST)
N$24: BT1.+ U11.14(VBAT)
N$36: J9.1 Q5.8(D1_2)
N$37: J9.2 R29.1
N$38: J10.1 Q5.6(D2_2)
N$39: J10.2 R30.1
SPI_CD: J14.P9(CD) J15.7 R33.2
SPI_MISO: J14.P7(DAT0) J15.6 R34.2 ; also sheet 1
SPI_MOSI: J14.P3(CMD) J15.2 R37.1 ; also sheet 1
SPI_SCLK: J14.P5(CLK) J15.4 R35.2 ; also sheet 1
SPI_SS: J14.P2(CD/DAT3) J15.1 R36.1 ; also sheet 1
VCC: C18.2 C19.2 J14.P4(VDD) J15.3 R33.1 R34.1 R35.1 R36.2 R37.2 U11.2(VCC) ; also sheet 1,2,3,6,7
Unconnected: J14.P1(DAT2) J14.P8(DAT1) Q5.5(D2_1) Q5.7(D1_1)

### Notes on the sheet
- Input / Output (3/3)
- RTC | MicroSD
- I2C address of 0x68 | Based on Adafruit MicroSD Breakout
- Based on Adafruit DS3231 Precision RTC Breakout
- High Brightness LEDs
- Mosfet: IRF7341TRPBF
- Cathode | Anode
- Cathode | Anode

## Power pins joined to a net without a drawn wire
SHIELD: J16.P1(SHIELD) J16.P2(SHIELD) J16.P3(SHIELD) J16.P4(SHIELD) J16.P5(SHIELD) J16.P6(SHIELD)

## Library data of the parts
BT1 = UltraLibrarianParts:BS-7: BATTERY HOLDER COIN 20MM PC PIN Check availability <https://pricing.snapeda.com/parts/BS-7/MPD%20%28Memory/view-part?ref=eda>; AVAILABILITY: In Stock; DESCRIPTION: BATTERY HOLDER COIN 20MM PC PIN; MF: MPD (Memory; MP: BS-7; PACKAGE: None; PRICE: None; PURCHASE-URL: https://pricing.snapeda.com/search/part/BS-7/?ref=eda
C1-C13 C15-C22 = standardparts:CAPACITOR
C14 C23 = rcl:CPOL-EU: POLARIZED CAPACITOR, European symbol; SPICEPREFIX: C
CN2 = adafruit:JST_2PIN: JST 2-Pin Connectors of various flavors SMT-RA (S2B-PH-SM4) 4UConnector #17311 SMT (B2B-PH-SM4) THM-RA (S2B-PH) THM (B2B-PH)
D1-D3 D6-D13 = standardparts:LED
D4 D5 = UltraLibrarianParts:SS14-E3/5AT; COPYRIGHT: Copyright (C) 2022 Ultra Librarian. All rights reserved.; DIGI-KEY_PART_NUMBER_1: SS14-E3/5ATGICT-ND; DIGI-KEY_PART_NUMBER_2: SS14-E3/5ATGIDKR-ND; DIGI-KEY_PART_NUMBER_3: SS14-E3/5ATGITR-ND; MANUFACTURER_PART_NUMBER: SS14-E3/5AT; MFR_NAME: Vishay
D14 = UltraLibrarianParts:RS1BB-13-F; COPYRIGHT: Copyright (C) 2022 Ultra Librarian. All rights reserved.; DIGI-KEY_PART_NUMBER_1: RS1BB-FDICT-ND; DIGI-KEY_PART_NUMBER_2: RS1BB-FDIDKR-ND; DIGI-KEY_PART_NUMBER_3: RS1BB-FDITR-ND; MANUFACTURER_PART_NUMBER: RS1BB-13-F; MFR_NAME: Diodes Inc
H1-H4 = holes:MOUNT-HOLE: MOUNTING HOLE with drill center marker
J1 = Hippo-PS:CONN_06: Multi connection point. Often used as Generic Header-pin footprint for 0.1 inch spaced/style header connections On any of the 0.1 inch spaced packages, you can populate with these: Break Away Headers - Straight <https://www.sparkfun.com/products/116> (PRT-00116) Break Away Male Headers - Right Angle <https://www.sparkfun.com/products/553> (PRT-00553) Female Headers <https://www.sparkfun.com/products/115> (PRT-00115) Break Away Headers - Machine Pin <https://www.sparkfun.com/products/117> (PRT-00117) Break Away Female Headers - Swiss Machine Pin <https://www.sparkfun.com/products/743> (PRT-00743) Arduino Stackable Header - 6 Pin <https://www.sparkfun.com/products/9280> (PRT-09280) For SCREWTERMINALS and SPRING TERMINALS visit here: Screw Terimnals on SparkFun.com <https://www.sparkfun.com/search/results?term=Screw+Terminals> (5mm/3.5mm/2.54mm spacing) This device is also useful as a general connection point to wire up your design to another part of your project. Our various solder wires solder well into these plated through hole pads. Hook-Up Wire - Assortment (Stranded, 22 AWG) <https://www.sparkfun.com/products/11375> (PRT-11375) Hook-Up Wire - Assortment (Solid Core, 22 AWG) <https://www.sparkfun.com/products/11367> (PRT-11367) View the entire wire category on our website here <https://www.sparkfun.com/categories/141>
J2 J4 J5 = SparkFun-Connectors:QWIIC_CONNECTOR: SparkFun I2C Standard Qwiic Connector An SMD 1mm pitch JST connector makes it easy and quick (get it? Qwiic?) to connect I2C devices to each other. The Qwiic system <http://www.sparkfun.com/qwiic> enables fast and solderless connection between popular platforms and various sensors and actuators. We carry 200mm <https://www.sparkfun.com/products/14204>, 100mm <https://www.sparkfun.com/products/14205>, 50mm <https://www.sparkfun.com/products/14206>, and breadboard friendly <https://www.sparkfun.com/products/14207> Qwiic cables. We also offer 10 pcs strips <https://www.sparkfun.com/products/14323> the SMD connectors.
J3 J8 J12 J17 J18 = SparkFun-Connectors:CONN_03: Multi connection point. Often used as Generic Header-pin footprint for 0.1 inch spaced/style header connections On any of the 0.1 inch spaced packages, you can populate with these: Break Away Headers - Straight <https://www.sparkfun.com/products/116> (PRT-00116) Break Away Male Headers - Right Angle <https://www.sparkfun.com/products/553> (PRT-00553) Female Headers <https://www.sparkfun.com/products/115> (PRT-00115) Break Away Headers - Machine Pin <https://www.sparkfun.com/products/117> (PRT-00117) Break Away Female Headers - Swiss Machine Pin <https://www.sparkfun.com/products/743> (PRT-00743) Stackable Header - 3 Pin (Female, 0.1") <https://www.sparkfun.com/products/13875> (PRT-13875) For SCREWTERMINALS and SPRING TERMINALS visit here: Screw Terimnals on SparkFun.com <https://www.sparkfun.com/search/results?term=Screw+Terminals> (5mm/3.5mm/2.54mm spacing) This device is also useful as a general connection point to wire up your design to another part of your project. Our various solder wires solder well into these plated through hole pads. Hook-Up Wire - Assortment (Stranded, 22 AWG) <https://www.sparkfun.com/products/11375> (PRT-11375) Hook-Up Wire - Assortment (Solid Core, 22 AWG) <https://www.sparkfun.com/products/11367> (PRT-11367) View the entire wire category on our website here <https://www.sparkfun.com/categories/141> Special notes: Molex polarized connector foot print use with SKU : PRT-08232 with associated crimp pins and housings.
J6 J7 J13 = SparkFun-Connectors:CONN_02: Multi connection point. Often used as Generic Header-pin footprint for 0.1 inch spaced/style header connections On any of the 0.1 inch spaced packages, you can populate with these: Break Away Headers - Straight <https://www.sparkfun.com/products/116> (PRT-00116) Break Away Male Headers - Right Angle <https://www.sparkfun.com/products/553> (PRT-00553) Female Headers <https://www.sparkfun.com/products/115> (PRT-00115) Break Away Headers - Machine Pin <https://www.sparkfun.com/products/117> (PRT-00117) Break Away Female Headers - Swiss Machine Pin <https://www.sparkfun.com/products/743> (PRT-00743) For SCREWTERMINALS and SPRING TERMINALS visit here: Screw Terimnals on SparkFun.com <https://www.sparkfun.com/search/results?term=Screw+Terminals> (5mm/3.5mm/2.54mm spacing) This device is also useful as a general connection point to wire up your design to another part of your project. Our various solder wires solder well into these plated through hole pads. Hook-Up Wire - Assortment (Stranded, 22 AWG) <https://www.sparkfun.com/products/11375> (PRT-11375) Hook-Up Wire - Assortment (Solid Core, 22 AWG) <https://www.sparkfun.com/products/11367> (PRT-11367) View the entire wire category on our website here <https://www.sparkfun.com/categories/141> Special notes: Molex polarized connector foot print use with: PRT-08233 with associated crimp pins and housings. 2.54_SCREWTERM for use with PRT-10571. 3.5mm Screw Terminal footprints for PRT-08084 5mm Screw Terminal footprints for use with PRT-08432
J9 J10 = SparkFun-Connectors:CONN_02: Multi connection point. Often used as Generic Header-pin footprint for 0.1 inch spaced/style header connections On any of the 0.1 inch spaced packages, you can populate with these: Break Away Headers - Straight <https://www.sparkfun.com/products/116> (PRT-00116) Break Away Male Headers - Right Angle <https://www.sparkfun.com/products/553> (PRT-00553) Female Headers <https://www.sparkfun.com/products/115> (PRT-00115) Break Away Headers - Machine Pin <https://www.sparkfun.com/products/117> (PRT-00117) Break Away Female Headers - Swiss Machine Pin <https://www.sparkfun.com/products/743> (PRT-00743) For SCREWTERMINALS and SPRING TERMINALS visit here: Screw Terimnals on SparkFun.com <https://www.sparkfun.com/search/results?term=Screw+Terminals> (5mm/3.5mm/2.54mm spacing) This device is also useful as a general connection point to wire up your design to another part of your project. Our various solder wires solder well into these plated through hole pads. Hook-Up Wire - Assortment (Stranded, 22 AWG) <https://www.sparkfun.com/products/11375> (PRT-11375) Hook-Up Wire - Assortment (Solid Core, 22 AWG) <https://www.sparkfun.com/products/11367> (PRT-11367) View the entire wire category on our website here <https://www.sparkfun.com/categories/141> Special notes: Molex polarized connector foot print use with: PRT-08233 with associated crimp pins and housings. 2.54_SCREWTERM for use with PRT-10571. 3.5mm Screw Terminal footprints for PRT-08084 5mm Screw Terminal footprints for use with PRT-08432; SF_SKU: PRT-08432
J11 = SparkFun-Connectors:CONN_03: Multi connection point. Often used as Generic Header-pin footprint for 0.1 inch spaced/style header connections On any of the 0.1 inch spaced packages, you can populate with these: Break Away Headers - Straight <https://www.sparkfun.com/products/116> (PRT-00116) Break Away Male Headers - Right Angle <https://www.sparkfun.com/products/553> (PRT-00553) Female Headers <https://www.sparkfun.com/products/115> (PRT-00115) Break Away Headers - Machine Pin <https://www.sparkfun.com/products/117> (PRT-00117) Break Away Female Headers - Swiss Machine Pin <https://www.sparkfun.com/products/743> (PRT-00743) Stackable Header - 3 Pin (Female, 0.1") <https://www.sparkfun.com/products/13875> (PRT-13875) For SCREWTERMINALS and SPRING TERMINALS visit here: Screw Terimnals on SparkFun.com <https://www.sparkfun.com/search/results?term=Screw+Terminals> (5mm/3.5mm/2.54mm spacing) This device is also useful as a general connection point to wire up your design to another part of your project. Our various solder wires solder well into these plated through hole pads. Hook-Up Wire - Assortment (Stranded, 22 AWG) <https://www.sparkfun.com/products/11375> (PRT-11375) Hook-Up Wire - Assortment (Solid Core, 22 AWG) <https://www.sparkfun.com/products/11367> (PRT-11367) View the entire wire category on our website here <https://www.sparkfun.com/categories/141> Special notes: Molex polarized connector foot print use with SKU : PRT-08232 with associated crimp pins and housings.; PROD_ID: CONN-10925
J14 = UltraLibrarianParts:MEM2075-00-140-01-A; COPYRIGHT: Copyright (C) 2022 Ultra Librarian. All rights reserved.; DIGI-KEY_PART_NUMBER_1: 2073-MEM2075-00-140-01-ACT-ND; DIGI-KEY_PART_NUMBER_2: 2073-MEM2075-00-140-01-ADKR-ND; DIGI-KEY_PART_NUMBER_3: 2073-MEM2075-00-140-01-ATR-ND; MANUFACTURER_PART_NUMBER: MEM2075-00-140-01-A; MFR_NAME: Global Connector Technology
J15 = SparkFun-Connectors:CONN_07: Multi connection point. Often used as Generic Header-pin footprint for 0.1 inch spaced/style header connections On any of the 0.1 inch spaced packages, you can populate with these: Break Away Headers - Straight <https://www.sparkfun.com/products/116> (PRT-00116) Break Away Male Headers - Right Angle <https://www.sparkfun.com/products/553> (PRT-00553) Female Headers <https://www.sparkfun.com/products/115> (PRT-00115) Break Away Headers - Machine Pin <https://www.sparkfun.com/products/117> (PRT-00117) Break Away Female Headers - Swiss Machine Pin <https://www.sparkfun.com/products/743> (PRT-00743) For SCREWTERMINALS and SPRING TERMINALS visit here: Screw Terimnals on SparkFun.com <https://www.sparkfun.com/search/results?term=Screw+Terminals> (5mm/3.5mm/2.54mm spacing) This device is also useful as a general connection point to wire up your design to another part of your project. Our various solder wires solder well into these plated through hole pads. Hook-Up Wire - Assortment (Stranded, 22 AWG) <https://www.sparkfun.com/products/11375> (PRT-11375) Hook-Up Wire - Assortment (Solid Core, 22 AWG) <https://www.sparkfun.com/products/11367> (PRT-11367) View the entire wire category on our website here <https://www.sparkfun.com/categories/141> Special notes: Molex polarized connector foot print use with SKU : PRT-08231 with associated crimp pins and housings. 1MM SMD Version SKU: PRT-10208 NOTES ON THE VARIANTS LOCK and LOCK_LONGPADS... This footprint was designed to help hold the alignment of a through-hole component (i.e. 6-pin header) while soldering it into place. You may notice that each hole has been shifted either up or down by 0.005 of an inch from it's more standard position (which is a perfectly straight line). This slight alteration caused the pins (the squares in the middle) to touch the edges of the holes. Because they are alternating, it causes a "brace" to hold the component in place. 0.005 has proven to be the perfect amount of "off-center" position when using our standard breakaway headers. Although looks a little odd when you look at the bare footprint, once you have a header in there, the alteration is very hard to notice. Also,if you push a header all the way into place, it is covered up entirely on the bottom side.
J16 = UltraLibrarianParts:10103592-0001LF-EK: Conn Micro USB Type B RCP 5 POS 0.65mm Solder RA SMD 5 Terminal 1 Port T/R; ARROW_ELECTRONICS-PURCHASE-URL: https://snapeda.com/shop?store=Arrow+Electronics&id=1274744; DESCRIPTION: USB - micro B USB 2.0 Receptacle Connector 5 Position Surface Mount, Right Angle; Through Hole; DIGI-KEY_PART_NUMBER: 609-4048-1-ND; DIGIKEY-PURCHASE-URL: https://snapeda.com/shop?store=DigiKey&id=1274744; MF: Amphenol ICC; MOUSER-PURCHASE-URL: https://snapeda.com/shop?store=Mouser&id=1274744; MP: 10103592-0001LF; PACKAGE: None
J19 = UltraLibrarianParts:PJ-102AH: 2.0 mm Center Pin, 5.0 A, Right Angle, Through Hole, Tapered Pins, Dc Power Jack Connector; CUI_PURCHASE_URL: https://www.cuidevices.com/product/interconnect/connectors/dc-power-connectors/jacks/pj-102ah?utm_source=snapeda.com&utm_medium=referral&utm_campaign=snapedaBOM; DESCRIPTION: 2.0 x 6.5 mm, 5.0 A, Horizontal, Through Hole, Tapered Pins, Dc Power Jack Connector; DIGI-KEY_PART_NUMBER: CP-102AH-ND; MF: CUI Devices; MP: PJ-102AH; PACKAGE: None; PURCHASE-URL: https://pricing.snapeda.com/search/part/PJ-102AH/?ref=eda
L1 = UltraLibrarianParts:NRH2410T2R2MN; COPYRIGHT: Copyright (C) 2022 Ultra Librarian. All rights reserved.; DIGI-KEY_PART_NUMBER_1: 587-2388-1-ND; DIGI-KEY_PART_NUMBER_2: 587-2388-2-ND; DIGI-KEY_PART_NUMBER_3: 587-2388-6-ND; MANUFACTURER_PART_NUMBER: NRH2410T2R2MN; MFR_NAME: Taiyo Yuden
L2 = UltraLibrarianParts:NRS5024T2R2NMGJ; COPYRIGHT: Copyright (C) 2022 Ultra Librarian. All rights reserved.; DIGI-KEY_PART_NUMBER_1: 587-6102-2-ND; DIGI-KEY_PART_NUMBER_2: 587-6102-1-ND; DIGI-KEY_PART_NUMBER_3: 587-6102-6-ND; MANUFACTURER_PART_NUMBER: NRS5024T2R2NMGJ; MFR_NAME: Taiyo Yuden
LED1 LED2 = UltraLibrarianParts:WS2812B: Check availability <https://pricing.snapeda.com/parts/WS2812B/SparkFun%20Electronics/view-part?ref=eda>; AVAILABILITY: Not in stock; DESCRIPTION: Raspberry Pi HAT (40 pin) Wheeled Robotics Kit; MF: SparkFun Electronics; MP: WS2812B; PACKAGE: None; PRICE: None
LED3 = UltraLibrarianParts:ALS-PT19-315C/L177/TR8; COPYRIGHT: Copyright (C) 2022 Ultra Librarian. All rights reserved.; DIGI-KEY_PART_NUMBER_1: 1080-1244-2-ND; DIGI-KEY_PART_NUMBER_2: 1080-1244-1-ND; DIGI-KEY_PART_NUMBER_3: 1080-1244-6-ND; MANUFACTURER_PART_NUMBER: ALS-PT19-315C/L177/TR8; MFR_NAME: Everlight
LS1 = UltraLibrarianParts:SMT-1341-T-HT-R; DESCRIPTION: SURFACE MOUNT TRANSDUCER 5 VP-P; DIGI-KEY_PART_NUMBER: 668-SMT-1341-T-HT-RTR-ND; MF: PUI Audio, Inc.; MP: SMT-1341-T-HT-R; PACKAGE: PUI Audio, Inc.; PURCHASE-URL: https://pricing.snapeda.com/search/part/SMT-1341-T-HT-R/?ref=eda
Q1 Q2 = BC846:BC846: NPN TRANSISTOR Check availability <https://pricing.snapeda.com/parts/BC846/Rectron/view-part?ref=eda>; AVAILABILITY: In Stock; DESCRIPTION: Trans GP BJT NPN 65V 0.1A 3-Pin SOT-23; MF: Rectron; MP: BC846; PACKAGE: SOT-23-3 Rectron; PRICE: None
Q3 = AO3401:AO3401: Check availability <https://pricing.snapeda.com/parts/AO3401/Alpha%20%26%20Omega%20Semiconductor/view-part?ref=eda>; AVAILABILITY: In Stock; DESCRIPTION: P-Channel 30 V 4A (Ta) 1.4W (Ta) Surface Mount SOT-23-3; MF: Alpha & Omega Semiconductor; MP: AO3401; PACKAGE: SOT-23-3 Alpha &amp; Omega Semiconductor; PRICE: None; PURCHASE-URL: https://pricing.snapeda.com/search/part/AO3401/?ref=eda
Q4 = Hippo-PS:PN2222A-SOT-23: MMBT3904 series 40V 200mA SOT23 NPN Switching Transistor Check availability <https://pricing.snapeda.com/parts/MMBT3904%2C215/Nexperia%20USA/view-part?ref=eda>; AVAILABILITY: In Stock; DESCRIPTION: Bipolar (BJT) Transistor NPN 40 V 200 mA 300MHz 250 mW Surface Mount TO-236AB; MF: Nexperia USA; MP: MMBT3904,215; PACKAGE: SOT23-3 Nexperia USA Inc.; PRICE: None; PURCHASE-URL: https://pricing.snapeda.com/search/part/MMBT3904,215/?ref=eda
Q5 = UltraLibrarianParts:IRF7341TRPBF: MOSFET MOSFT DUAL NCh 55V 4.7A Source: Datasheet <https://componentsearchengine.com/Datasheets/1/IRF7341TRPBF.pdf> Check availability <https://pricing.snapeda.com/parts/IRF7341TRPBF/Infineon/view-part?ref=eda>; AVAILABILITY: In Stock; DESCRIPTION: Mosfet Array 2 N-Channel (Dual) 55V 4.7A 2W Surface Mount 8-SO; MF: Infineon; MP: IRF7341TRPBF; PACKAGE: SOIC-8 International Rectifier; PRICE: None; PURCHASE-URL: https://pricing.snapeda.com/search/part/IRF7341TRPBF/?ref=eda
R1-R28 R31-R45 = standardparts:RESISTOR
R29 R30 = UltraLibrarianParts:CRM2512-JW-3R3ELF; DESCRIPTION: 3.3 Ohms ±5% 2W Chip Resistor 2512 (6432 Metric) Current Sense Thick Film; DIGI-KEY_PART_NUMBER: CRM2512-JW-3R3ELFTR-ND; MF: Bourns; MP: CRM2512-JW-3R3ELF; PACKAGE: 6331 Bourns; PURCHASE-URL: https://pricing.snapeda.com/search/part/CRM2512-JW-3R3ELF/?ref=eda
S1 S2 S4 = SparkFun-Switches:MOMENTARY-SWITCH-SPST: Momentary Switch (Pushbutton) - SPST Normally-open (NO) SPST momentary switches (buttons, pushbuttons). Variants PTH-12MM - 12mm square, through-hole Momentary Pushbutton Switch - 12mm Square <https://www.sparkfun.com/products/9190> (COM-09190) PTH-6.0MM, PTH-6.0MM-KIT - 6.0mm square, through-hole Mini Pushbutton Switch <https://www.sparkfun.com/products/97> (COM-00097) KIT package intended for soldering kit's - only one side of pads' copper is exposed. PTH-RIGHT-ANGLE-KIT - Right-angle, through-hole Right Angle Tactile Button <https://www.sparkfun.com/products/10791> - Used on SparkFun BigTime Watch Kit <https://www.sparkfun.com/products/11734> SMD-12MM - 12mm square, surface-mount Tactile Button - SMD (12mm) <https://www.sparkfun.com/products/12993> (COM-12993) Used on SparkFun PicoBoard <https://www.sparkfun.com/products/11888> SMD-4.5MM - 4.5mm Square Trackball Switch Used on SparkFun Blackberry Trackballer Breakout <https://www.sparkfun.com/products/13169> SMD-4.6MMX2.8MM - 4.60mm x 2.80mm, surface mount Used on SparkFun SAMD21 Mini Breakout <https://www.sparkfun.com/products/13664> SMD-5.2MM, SMD-5.2-REDUNDANT - 5.2mm square, surface-mount Mini Pushbutton Switch - SMD <https://www.sparkfun.com/products/8720> (COM-08720) Used on Arduino Pro Mini <https://www.sparkfun.com/products/11114> REDUNDANT package connects both switch circuits together SMD-6.0X3.5MM - 6.0 x 3.5mm, surface mount Momentary Reset Switch SMD <https://www.sparkfun.com/products/8229> (COM-08229) SMD-6.2MM-TALL - 6.2mm square, surface mount Tactile Button - SMD (6mm) <https://www.sparkfun.com/products/12992> Used on SparkFun Digital Sandbox <https://www.sparkfun.com/products/12651> SMD-RIGHT-ANGLE - Right-angle, surface mount Used on SparkFun Block for Intel® Edison - Arduino <https://www.sparkfun.com/products/13036>; PROD_ID: SWCH-08247; SF_SKU: COM-08720
S5 = UltraLibrarianParts:EG1224; DESCRIPTION: Slide Switch SPDT Through Hole, Right Angle; DIGI-KEY_PART_NUMBER: EG2585-ND; MF: E-Switch; MP: EG1224; PACKAGE: None; PURCHASE-URL: https://pricing.snapeda.com/search/part/EG1224/?ref=eda
TP1-TP11 TP64 TP65 = UltraLibrarianParts:TP
TP12-TP63 TP66 TP67 = SparkFun-Connectors:TEST-POINT: SparkFun Test Points Bare copper test points for troubleshooting or In-Circuit-Testing. These are used by our Production team for verifying production board runs using pogo-pins on test beds. SparkFun Products: SparkFun LSM9DS1 Breakout <https://www.sparkfun.com/products/13284> SparkFun PSOC <https://www.sparkfun.com/products/13714> SparkFun Load Cell Amplifier <https://www.sparkfun.com/products/13879>
U1 = ESP32-WROOM-32D:ESP32-WROOM-32D: Bluetooth, WiFi 802.11b/g/n, Bluetooth v4.2 + EDR, Class 1, 2 and 3 Transceiver Module 2.4GHz ~ 2.5GHz Integrated, Trace Surface Mount Check availability <https://pricing.snapeda.com/parts/ESP32-WROOM-32D/Espressif%20Systems/view-part?ref=eda>; AVAILABILITY: In Stock; DESCRIPTION: Bluetooth, WiFi 802.11b/g/n, Bluetooth v4.2 +EDR, Class 1, 2 and 3 Transceiver Module 2.4GHz ~ 2.5GHz Integrated; MF: Espressif Systems; MP: ESP32-WROOM-32D; PACKAGE: Module Espressif Systems; PRICE: None; PURCHASE-URL: https://pricing.snapeda.com/search/part/ESP32-WROOM-32D/?ref=eda
U2 = AP2111H-3.3TRG1:AP2111H-3.3TRG1; COPYRIGHT: Copyright (C) 2022 Ultra Librarian. All rights reserved.; DIGI-KEY_PART_NUMBER_1: AP2111H-3.3TRG1DICT-ND; DIGI-KEY_PART_NUMBER_2: AP2111H-3.3TRG1DIDKR-ND; DIGI-KEY_PART_NUMBER_3: AP2111H-3.3TRG1DITR-ND; MANUFACTURER_PART_NUMBER: AP2111H-3.3TRG1; MFR_NAME: Diodes Inc
U3 = CP2102N-A02-GQFN24:CP2102N-A02-GQFN24; COPYRIGHT: Copyright (C) 2022 Ultra Librarian. All rights reserved.; DIGI-KEY_PART_NUMBER_1: 336-5887-ND; MANUFACTURER_PART_NUMBER: CP2102N-A02-GQFN24; MFR_NAME: Silicon Labs
U4 = UltraLibrarianParts:MCP73831T-3ACI/OT; COPYRIGHT: Copyright (C) 2022 Ultra Librarian. All rights reserved.; DIGI-KEY_PART_NUMBER_1: MCP73831T-3ACI/OTCT-ND; DIGI-KEY_PART_NUMBER_2: MCP73831T-3ACI/OTDKR-ND; DIGI-KEY_PART_NUMBER_3: MCP73831T-3ACI/OTTR-ND; MANUFACTURER_PART_NUMBER: MCP73831T-3ACI/OT; MFR_NAME: Microchip
U5 = UltraLibrarianParts:TPS613222ADBVT; COPYRIGHT: Copyright (C) 2022 Ultra Librarian. All rights reserved.; DIGI-KEY_PART_NUMBER_1: 296-49468-1-ND; DIGI-KEY_PART_NUMBER_2: 296-49468-2-ND; DIGI-KEY_PART_NUMBER_3: 296-49468-6-ND; MANUFACTURER_PART_NUMBER: TPS613222ADBVT; MFR_NAME: Texas Instruments; REFDES: RefDes; TYPE: TYPE
U6 = UltraLibrarianParts:PAM2401SCADJ; COPYRIGHT: Copyright (C) 2022 Ultra Librarian. All rights reserved.; MANUFACTURER_PART_NUMBER: PAM2401SCADJ; MFR_NAME: Diodes Inc
U7 = UltraLibrarianParts:ZXBM5210-SP-13; COPYRIGHT: Copyright (C) 2022 Ultra Librarian. All rights reserved.; MANUFACTURER_PART_NUMBER: ZXBM5210-SP-13; MFR_NAME: Diodes Inc
U8 = UltraLibrarianParts:BSS138; COPYRIGHT: Copyright (C) 2022 Ultra Librarian. All rights reserved.; DIGI-KEY_PART_NUMBER_1: 1801-BSS138CT-ND; DIGI-KEY_PART_NUMBER_2: 1801-BSS138DKR-ND; DIGI-KEY_PART_NUMBER_3: 1801-BSS138TR-ND; DIGI-KEY_PART_NUMBER_4: 2156-BSS138-ND; DIGI-KEY_PART_NUMBER_5: 2156-BSS138-OS-ND; DIGI-KEY_PART_NUMBER_6: BSS138-DIE-ND; DIGI-KEY_PART_NUMBER_7: BSS138CT-ND; DIGI-KEY_PART_NUMBER_8: BSS138DKR-ND; DIGI-KEY_PART_NUMBER_9: BSS138TR-ND; MANUFACTURER_PART_NUMBER: BSS138; MFR_NAME: onsemi
U9 = UltraLibrarianParts:TS2940CW50_RPG; DESCRIPTION: 1A 5V ULTRA LOW DROPOUT VOLTAGE REGULATOR; DIGI-KEY_PART_NUMBER: 1801-TS2940CW50RPGTR-ND; MF: Taiwan Semiconductor Corporation; MP: TS2940CW50 RPG; PACKAGE: SOT-223 Taiwan Semiconductor; PURCHASE-URL: https://pricing.snapeda.com/search/part/TS2940CW50 RPG/?ref=eda
U10 = UltraLibrarianParts:AH1807-W-7; COPYRIGHT: Copyright (C) 2022 Ultra Librarian. All rights reserved.; DIGI-KEY_PART_NUMBER_1: AH1807-W-7DICT-ND; DIGI-KEY_PART_NUMBER_2: AH1807-W-7DIDKR-ND; DIGI-KEY_PART_NUMBER_3: AH1807-W-7DITR-ND; MANUFACTURER_PART_NUMBER: AH1807-W-7; MFR_NAME: Diodes Inc
U11 = UltraLibrarianParts:DS3231M+TRL; COPYRIGHT: Copyright (C) 2022 Ultra Librarian. All rights reserved.; DIGI-KEY_PART_NUMBER_1: DS3231M+TRL-ND; DIGI-KEY_PART_NUMBER_2: DS3231M+TRLCT-ND; DIGI-KEY_PART_NUMBER_3: DS3231M+TRLDKR-ND; DIGI-KEY_PART_NUMBER_4: DS3231M+TRLTR-ND; MANUFACTURER_PART_NUMBER: DS3231M+TRL; MFR_NAME: Maxim Integrated Products
U12 = UltraLibrarianParts:MC74HC595ADR2G; COPYRIGHT: Copyright (C) 2022 Ultra Librarian. All rights reserved.; DIGI-KEY_PART_NUMBER_1: 2156-MC74HC595ADR2G-OS-ND; DIGI-KEY_PART_NUMBER_2: =MC74HC595ADR2G; DIGI-KEY_PART_NUMBER_3: MC74HC595ADR2GOSCT-ND; DIGI-KEY_PART_NUMBER_4: MC74HC595ADR2GOSDKR-ND; DIGI-KEY_PART_NUMBER_5: MC74HC595ADR2GOSTR-ND; MANUFACTURER_PART_NUMBER: MC74HC595ADR2G; MFR_NAME: onsemi
X1 = adafruit_sensor:TMP235